# EasyEDA Pro project 中二手台.epro

# Schematic Schematic2
Create Date: 2024-07-02; Page Name: P1; Project Name: 若珺中二手台; Schematic Name: Schematic2; Update Date: 2024-07-21; Company: 嘉立创EDA; Page Size: A4; Version: V1.0
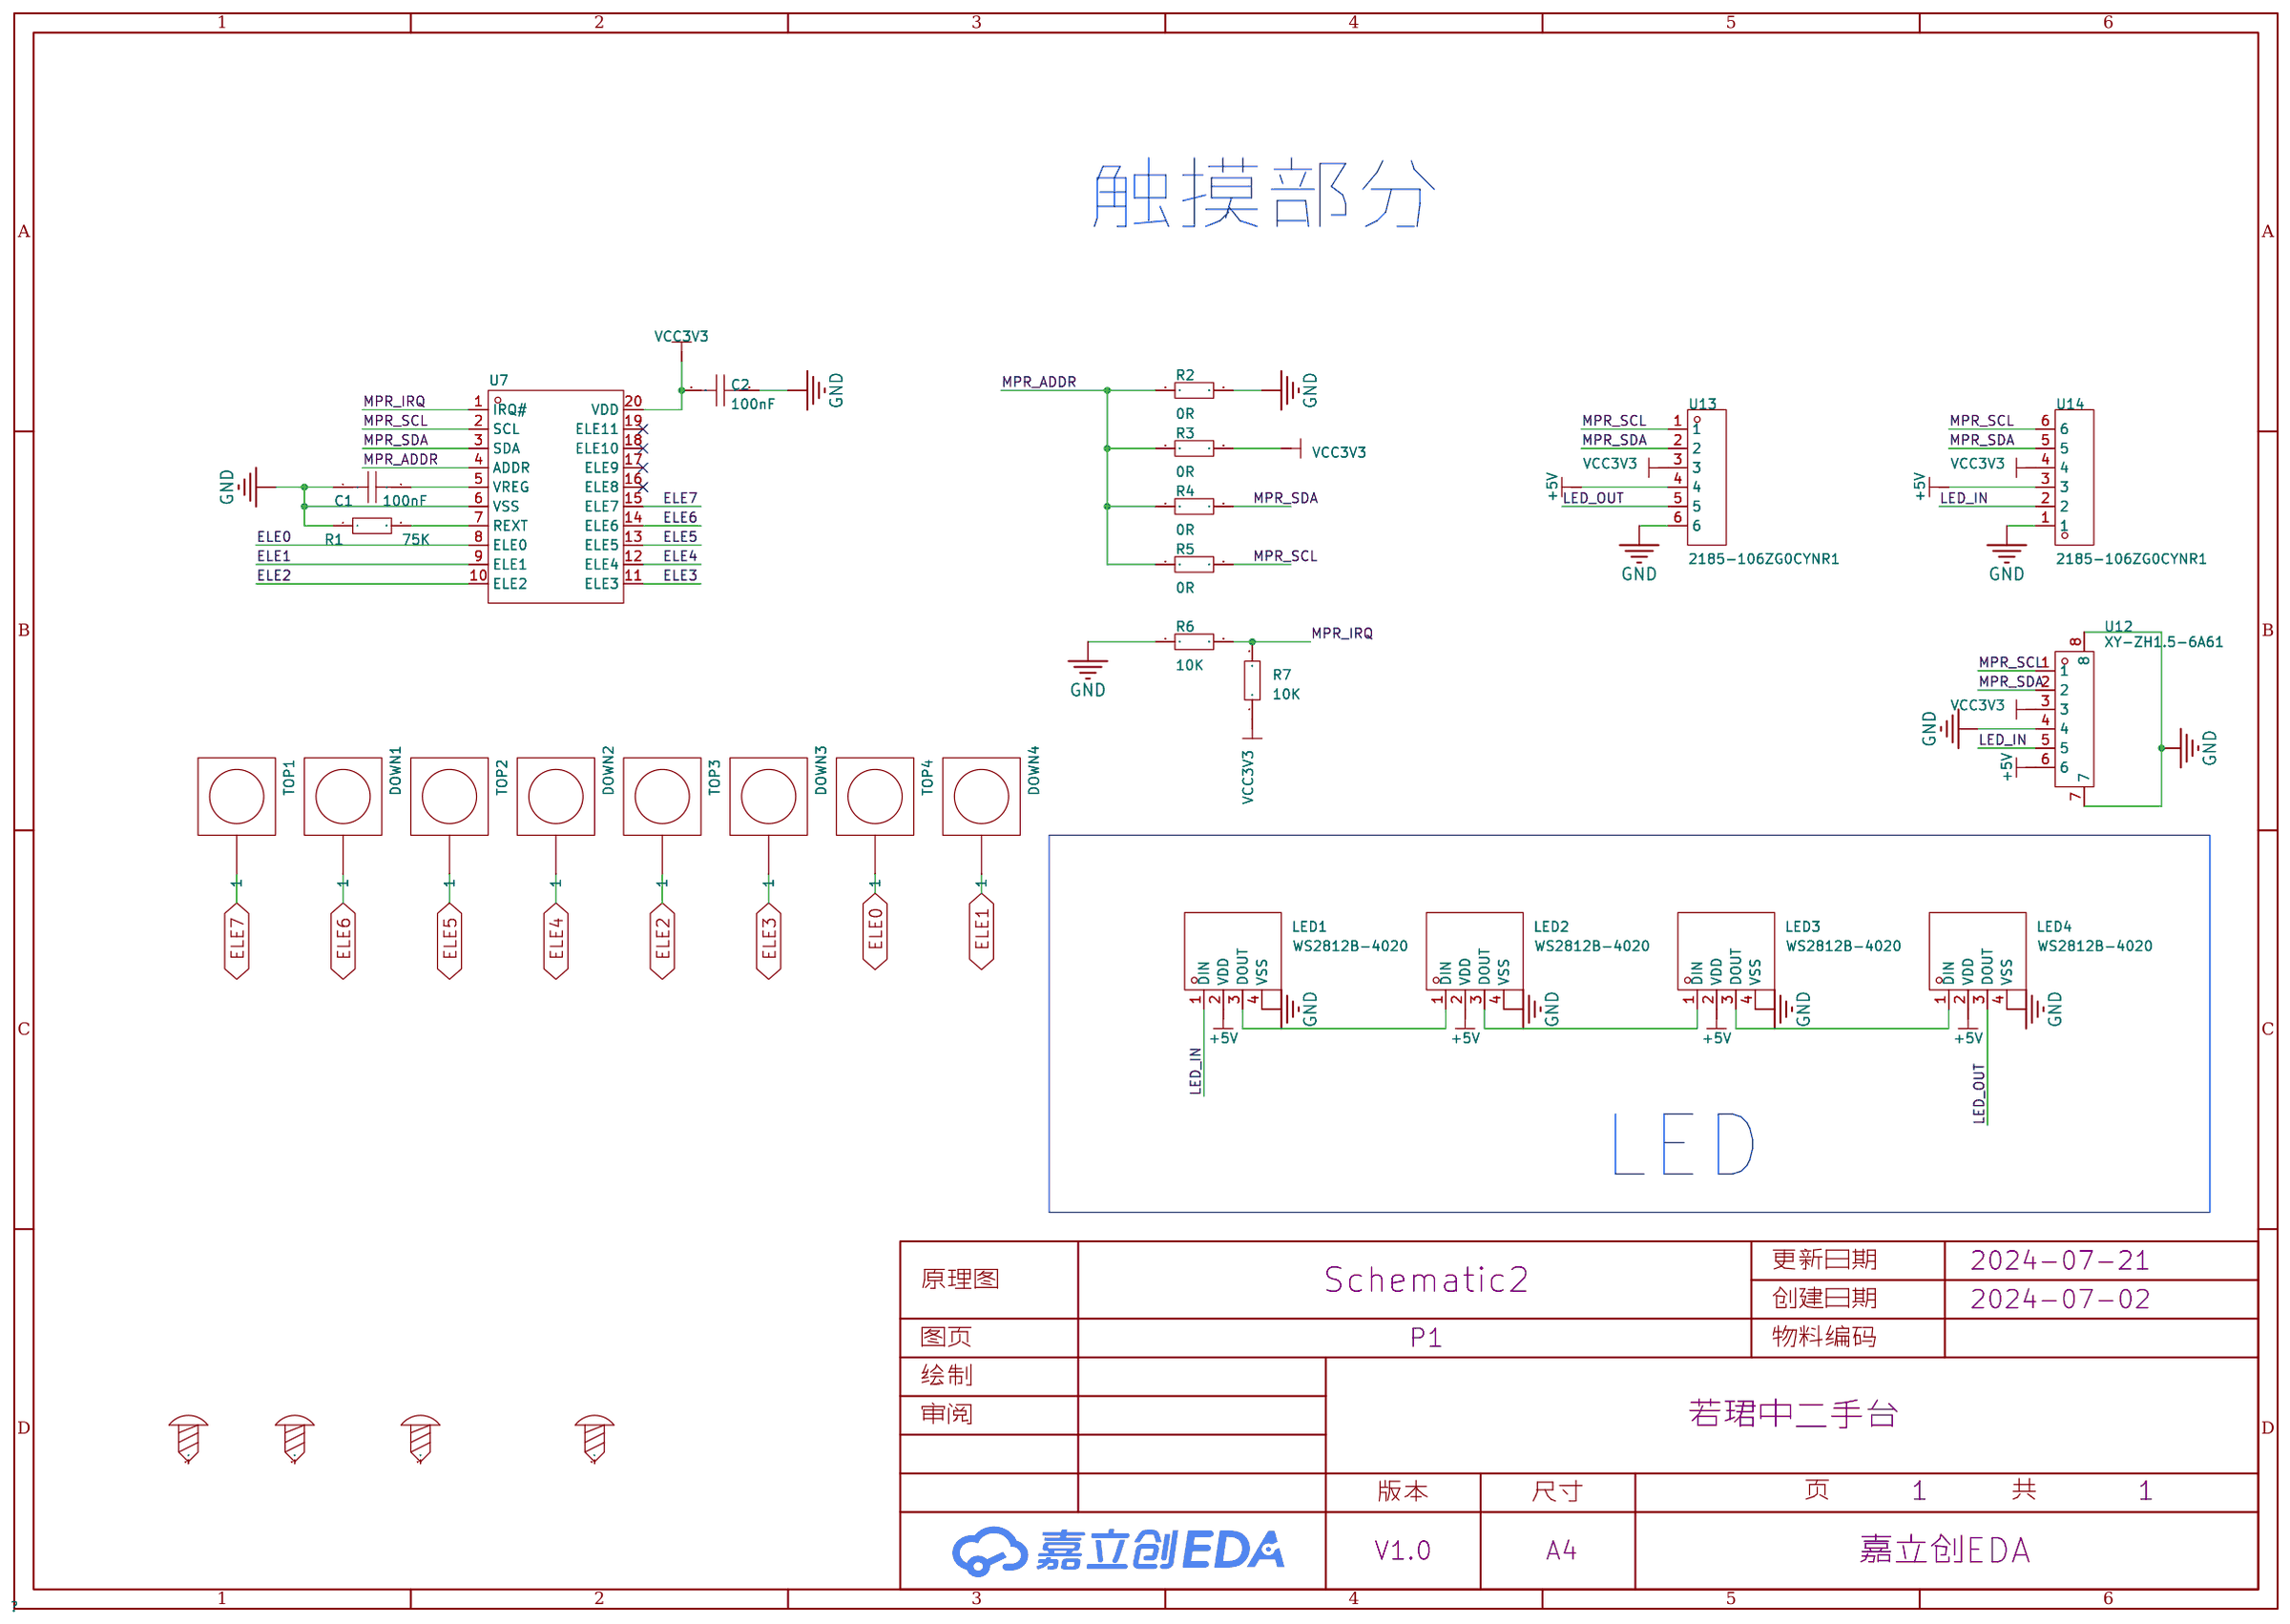
[diagram p0: schematic sheet]

## Parts
C1  100nF  [C0603]
C2  100nF  [C0603]
DOWN1  -  [触摸区域-焊盘]
DOWN2  -  [触摸区域-焊盘]
DOWN3  -  [触摸区域-焊盘]
DOWN4  -  [触摸区域-焊盘]
LED1  WS2812B-4020  [LED-SMD_WS2812B-4020]
LED2  WS2812B-4020  [LED-SMD_WS2812B-4020]
LED3  WS2812B-4020  [LED-SMD_WS2812B-4020]
LED4  WS2812B-4020  [LED-SMD_WS2812B-4020]
R1  75K  [R0603]
R2  0R  [R0603]
R3  0R  [R0603]
R4  0R  [R0603]
R5  0R  [R0603]
R6  10K  [R0603]
R7  10K  [R0603]
SCREW5  -  [M2螺丝]
SCREW6  -  [M2螺丝]
SCREW7  -  [M2螺丝]
SCREW8  -  [M2螺丝]
TOP1  -  [触摸区域-焊盘]
TOP2  -  [触摸区域-焊盘]
TOP3  -  [触摸区域-焊盘]
TOP4  -  [触摸区域-焊盘]
U7  -  [QFN-20_L3.0-W3.0-P0.40-BL]
U12  XY-ZH1.5-6A61  [CONN-SMD_6P-P1.50_XY-ZH1.5-6A61]
U13  2185-106ZG0CYNR1  [HDR-SMD_6P-P2.54-V-F_2185-106ZG0CYNR1]
U14  2185-106ZG0CYNR1  [HDR-SMD_6P-P2.54-V-F_2185-106ZG0CYNR1]

## Library data of the parts
C1 C2 = CAP_0603: Supplier Footprint: 0603
DOWN1-DOWN4 TOP1-TOP4 = 连接点（正方形，多层）
LED1-LED4 = WS2812B-4020: 发光颜色:RGB三色;二极管配置:-;透镜颜色:-;主波长:465nm~475nm；620nm~625nm；515nm~525nm;峰值波长:-;色温:-;测试电流:12mA;功率:-;发光角度:-;安装方式:-;工作温度:-;; LCSC Part Name: RGB三色 465nm~475nm 515nm~525nm 620nm~625nm （注意防潮，请查阅规格书中对应具体内容）; Supplier Part: C965557; Manufacturer: worldsemi; Supplier Footprint: SMD,2x4mm; JLCPCB Part Class: Extended Part; Datasheet: https://atta.szlcsc.com/upload/public/pdf/source/20201203/C965557_D4D919E14814D6BA44043987D39B5520.pdf; Supplier: LCSC; Emitted Color: RGB三色; Dominant Wavelength: 465nm~475nm；620nm~625nm；515nm~525nm; Forward Current: 12mA
R1-R7 = Res_0603: Supplier Footprint: 0603
SCREW5-SCREW8 = M2螺丝: Supplier Footprint: 插件
U7 = MPR121QR2: Supplier Part: C91322; Manufacturer: NXP(恩智浦); Supplier Footprint: QFN-20; JLCPCB Part Class: Extended Part; Datasheet: https://atta.szlcsc.com/upload/public/pdf/source/20180709/C91322_1B52007B7B61B701B66428E654A9AEF1.pdf; Supplier: LCSC
U12 = XY-ZH1.5-6A61: 插针结构:1x6P;间距:1.5mm;安装方式:卧贴;总PIN数:6P;排数:1;每排PIN数:6;行距:3.3mm;; LCSC Part Name: 间距:1.5mm 1x6P 卧贴; Supplier Part: C19272081; Manufacturer: XYECONN(辛译); Supplier Footprint: SMD,P=1.5mm,卧贴; Datasheet: https://atta.szlcsc.com/upload/public/pdf/source/20231128/469DECC5125F2C64AF36B40FBD9D9B8C.pdf; Supplier: LCSC; Pins Structure: 1x6P; Pitch: 1.5mm; Mounting Style: 卧贴; Number of Pins: 6P; Number of Rows: 1; Number of PINs Per Row: 6; Row Spacing: 3.3mm
U13 U14 = 2185-106ZG0CYNR1: Supplier Part: C9900021635; Supplier Footprint: HDR-SMD_6P-P2.54; JLCPCB Part Class: 扩展库; Supplier: LCSC

## Nets
+5V: LED1.2(VDD) LED2.2(VDD) LED3.2(VDD) LED4.2(VDD) U12.6 U13.4 U14.3
GND: C1.1 C2.2 LED1.4(VSS) LED2.4(VSS) LED3.4(VSS) LED4.4(VSS) R1.1 R2.2 R6.1 U7.6(VSS) U12.4 U12.7 U12.8 U13.6 U14.1
VCC3V3: C2.1 R3.2 R7.1 U7.20(VDD) U12.3 U13.3 U14.4
ELE0: TOP4.1 U7.8(ELE0)
ELE1: DOWN4.1 U7.9(ELE1)
ELE2: TOP3.1 U7.10(ELE2)
ELE3: DOWN3.1 U7.11(ELE3)
ELE4: DOWN2.1 U7.12(ELE4)
ELE5: TOP2.1 U7.13(ELE5)
ELE6: DOWN1.1 U7.14(ELE6)
ELE7: TOP1.1 U7.15(ELE7)
LED_IN: LED1.1(DIN) U12.5 U14.2
LED_OUT: LED4.3(DOUT) U13.5
MPR_ADDR: R2.1 R3.1 R4.1 R5.1 U7.4(ADDR)
MPR_IRQ: R6.2 R7.2 U7.1(IRQ#)
MPR_SCL: R5.2 U7.2(SCL) U12.1 U13.1 U14.6
MPR_SDA: R4.2 U7.3(SDA) U12.2 U13.2 U14.5
$1N5130: C1.2 U7.5(VREG)
$1N5218: R1.2 U7.7(REXT)
$1N6408: LED1.3(DOUT) LED2.1(DIN)
$1N6409: LED2.3(DOUT) LED3.1(DIN)
$1N6410: LED3.3(DOUT) LED4.1(DIN)

Not connected (* = marked no-connect by the designer): SCREW5 1; SCREW6 1; SCREW7 1; SCREW8 1; U7 16(ELE8)* 17(ELE9)* 18(ELE10)* 19(ELE11)*

## Notes on the sheet
- 触摸部分
- LED

# Schematic Schematic1
Create Date: 2024-06-29; Page Name: 主控天健; Project Name: 若珺中二手台; Schematic Name: Schematic1; Update Date: 2024-08-07; Company: 嘉立创EDA; Page Size: A4; Version: V1.0
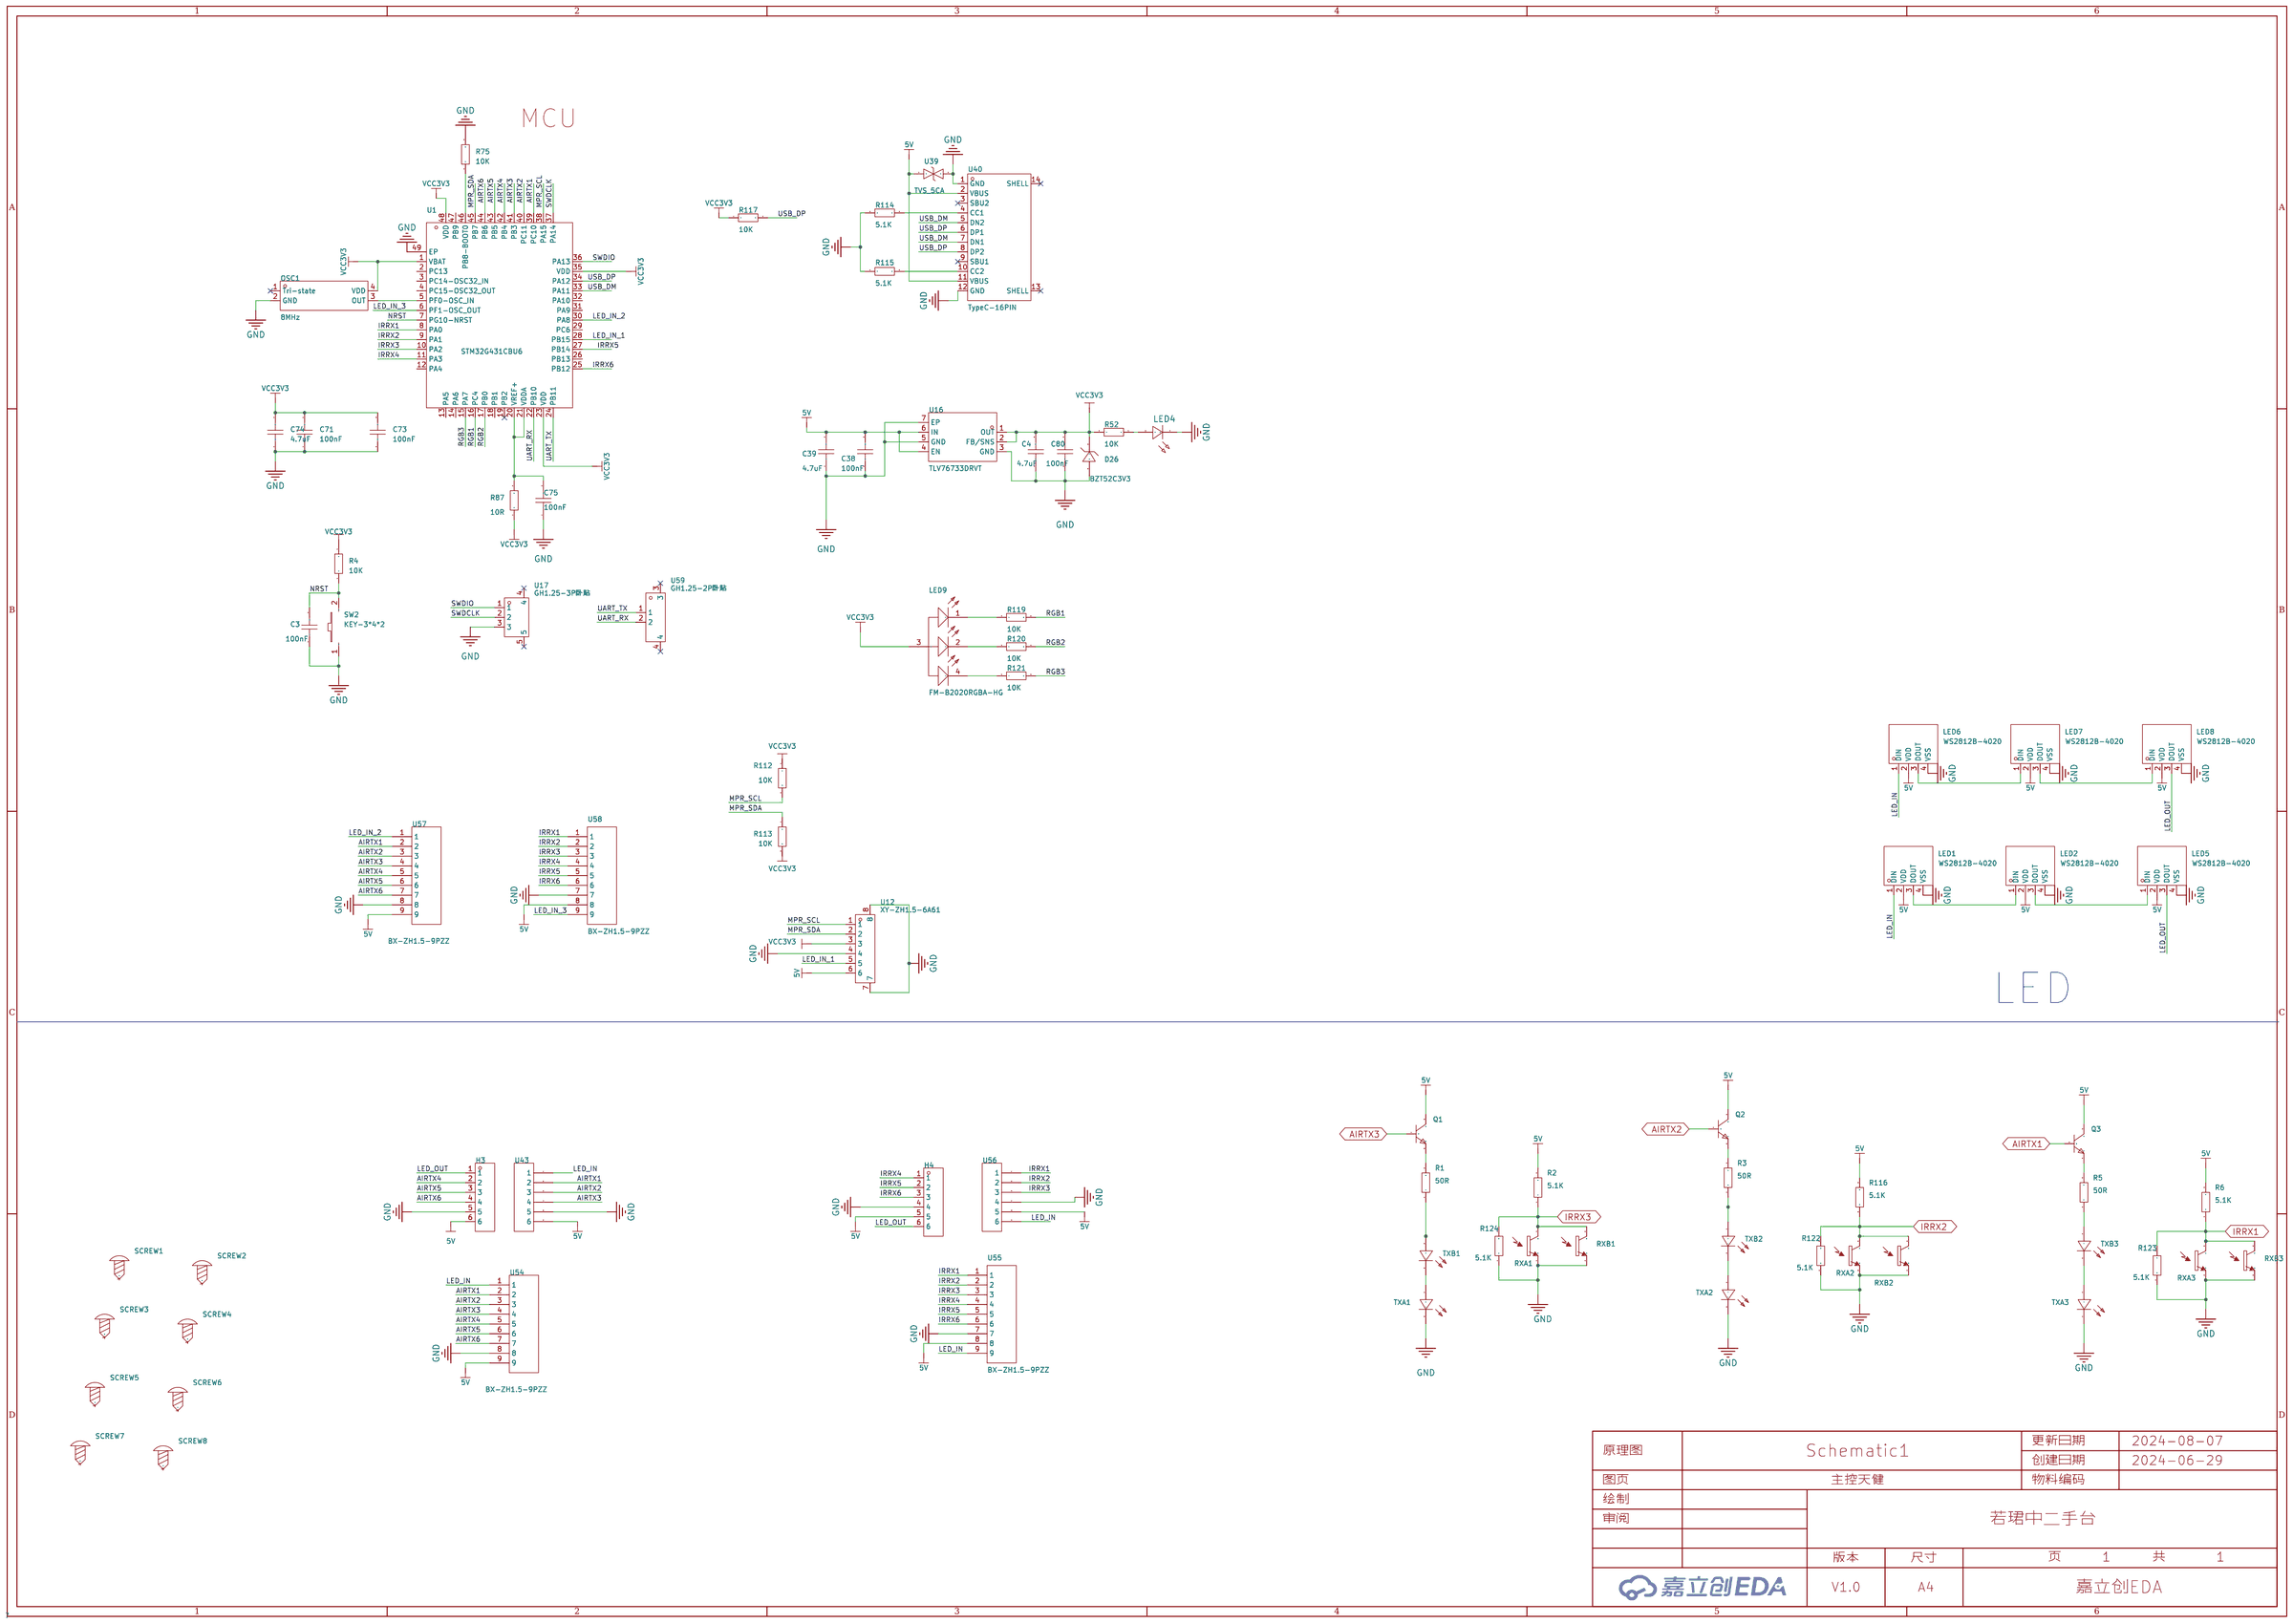
[diagram p1: schematic sheet]

## Parts
C3  100nF  [C0402]
C4  4.7uF  [c0402_new]
C38  100nF  [c0402_new]
C39  4.7uF  [c0402_new]
C71  100nF  [C0402]
C73  100nF  [C0402]
C74  4.7uF  [C0402]
C75  100nF  [C0402]
C80  100nF  [c0402_new]
D26  BZT52C3V3  [SOD-123_L2.7-W1.6-LS3.7-RD-1]
H3  -  [HDR-TH_6P-P2.54-V-F]
H4  -  [HDR-TH_6P-P2.54-V-F]
LED1  WS2812B-4020  [LED-SMD_WS2812B-4020]
LED2  WS2812B-4020  [LED-SMD_WS2812B-4020]
LED4  -  [LED_0402]
LED5  WS2812B-4020  [LED-SMD_WS2812B-4020]
LED6  WS2812B-4020  [LED-SMD_WS2812B-4020]
LED7  WS2812B-4020  [LED-SMD_WS2812B-4020]
LED8  WS2812B-4020  [LED-SMD_WS2812B-4020]
LED9  FM-B2020RGBA-HG  [LED-SMD_FM-B2020RGBA-HG]
OSC1  8MHz  [OSC-SMD_4P-L3.2-W2.5-BL-1]
Q1  -  [SOT-23-3_L2.9-W1.3-P1.90-LS2.4-BR]
Q2  -  [SOT-23-3_L2.9-W1.3-P1.90-LS2.4-BR]
Q3  -  [SOT-23-3_L2.9-W1.3-P1.90-LS2.4-BR]
R1  50R  [R0603]
R2  5.1K  [R0603]
R3  50R  [R0603]
R4  10K  [R0402]
R5  50R  [R0603]
R6  5.1K  [R0603]
R52  10K  [R0402]
R75  10K  [R0603]
R87  10R  [R0402]
R112  10K  [R0402]
R113  10K  [R0402]
R114  5.1K  [R0603]
R115  5.1K  [R0603]
R116  5.1K  [R0603]
R117  10K  [R0603]
R119  10K  [R0402]
R120  10K  [R0402]
R121  10K  [R0402]
R122  5.1K  [R0603]
R123  5.1K  [R0603]
R124  5.1K  [R0603]
RXA1  -  [LED-TH_BD5.0-P2.54-RD]
RXA2  -  [LED-TH_BD5.0-P2.54-RD]
RXA3  -  [LED-TH_BD5.0-P2.54-RD]
RXB1  -  [LED-TH_BD5.0-P2.54-RD]
RXB2  -  [LED-TH_BD5.0-P2.54-RD]
RXB3  -  [LED-TH_BD5.0-P2.54-RD]
SCREW1  -  [M2螺丝]
SCREW2  -  [M2螺丝]
SCREW3  -  [M2螺丝]
SCREW4  -  [M2螺丝]
SCREW5  -  [M2螺丝]
SCREW6  -  [M2螺丝]
SCREW7  -  [M2螺丝]
SCREW8  -  [M2螺丝]
SW2  KEY-3*4*2  [SW-SMD_L4.0-W2.9-LS5.0]
TXA1  -  [LED-TH_BD5.0-P2.54-FD]
TXA2  -  [LED-TH_BD5.0-P2.54-FD]
TXA3  -  [LED-TH_BD5.0-P2.54-FD]
TXB1  -  [LED-TH_BD5.0-P2.54-FD]
TXB2  -  [LED-TH_BD5.0-P2.54-FD]
TXB3  -  [LED-TH_BD5.0-P2.54-FD]
U1  STM32G431CBU6  [UFQFPN-48_L7.0-W7.0-P0.50-BL-EP]
U12  XY-ZH1.5-6A61  [CONN-SMD_6P-P1.50_XY-ZH1.5-6A61]
U16  TLV76733DRVT  [WSON-6_L2.0-W2.0-P0.65-TL-EP]
U17  GH1.25-3P卧贴  [CONN-SMD_GH1.25-3P]
U39  TVS_5CA  [SMA_L4.3-W2.7-LS5.0-BI]
U40  TypeC-16PIN  [USB-C-SMD_TYPE-C-6PIN-2MD-073]
U43  -  [5P_pcb接口-2.54mm]
U54  BX-ZH1.5-9PZZ  [CONN-TH_9P-P1.50_ZH-1.5]
U55  BX-ZH1.5-9PZZ  [CONN-TH_9P-P1.50_ZH-1.5]
U56  -  [5P_pcb接口-2.54mm]
U57  BX-ZH1.5-9PZZ  [CONN-TH_9P-P1.50_ZH-1.5]
U58  BX-ZH1.5-9PZZ  [CONN-TH_9P-P1.50_ZH-1.5]
U59  GH1.25-2P卧贴  [CONN-SMD_2P-P1.25_GH1.25-2P]

## Library data of the parts
C3 C71 C73-C75 = CAP_0402: Supplier Footprint: 0402
C4 C38 C39 C80 = CAP_0603: Supplier Footprint: 0603
D26 = BZT52C3V3: 二极管配置:-;稳压值(标称值):3.3V;稳压值(范围):3.3V~3.5V;功率:500mW;; Supplier Part: C2891770; Manufacturer: YONGYUTAI(永裕泰); Supplier Footprint: SOD-123; JLCPCB Part Class: 扩展库; Datasheet: https://atta.szlcsc.com/upload/public/pdf/source/20210901/8FC2376A01E96D0346FF8B134DC7A446.pdf; Supplier: LCSC; Zener Voltage (Nom): 3.3V; Reverse Leakage Current (Ir): 5uA@1V; Zener Voltage (Range): 3.3V~3.5V; Power Dissipation: 500mW; Zener Impedance (Zzt): 95Ω
H3 H4 = HDR-F_2.54_1x6P: Supplier Part: C40877; Supplier Footprint: 插件
LED1 LED2 LED5-LED8 = WS2812B-4020: 发光颜色:RGB三色;二极管配置:-;透镜颜色:-;主波长:465nm~475nm；620nm~625nm；515nm~525nm;峰值波长:-;色温:-;测试电流:12mA;功率:-;发光角度:-;安装方式:-;工作温度:-;; LCSC Part Name: RGB三色 465nm~475nm 515nm~525nm 620nm~625nm （注意防潮，请查阅规格书中对应具体内容）; Supplier Part: C965557; Manufacturer: worldsemi; Supplier Footprint: SMD,2x4mm; JLCPCB Part Class: Extended Part; Datasheet: https://atta.szlcsc.com/upload/public/pdf/source/20201203/C965557_D4D919E14814D6BA44043987D39B5520.pdf; Supplier: LCSC; Emitted Color: RGB三色; Dominant Wavelength: 465nm~475nm；620nm~625nm；515nm~525nm; Forward Current: 12mA
LED4 = LED_0402-R: Supplier Footprint: 0402
LED9 = FM-B2020RGBA-HG: 金线; Supplier Part: C108793; Manufacturer: 国星光电; Supplier Footprint: SMD,2.1x2.1mm; Datasheet: https://atta.szlcsc.com/upload/public/pdf/source/20180518/C108793_2518890ED811E900864AC79152D9E220.pdf; Supplier: LCSC
OSC1 = OT2EL4C4JI-111OLP-8M: 频率:8MHz;常温频差:±10ppm;输出模式:CMOS;工作电压:1.8V~3.3V;; LCSC Part Name: 8MHZ?1.8V-3.3V?±10PPM YSO110TR; Supplier Part: C5189450; Manufacturer: YXC(扬兴晶振); Supplier Footprint: SMD3225-4P; Datasheet: https://atta.szlcsc.com/upload/public/pdf/source/20221009/1148DEA51132416CC556CBB25766F9C8.pdf; Supplier: LCSC; Normal temperature Frequency Tolerance: ±10ppm; Output Type: CMOS; Supply Voltage: 1.8V~3.3V; Operating Temperature: -40℃~+85℃
Q1-Q3 = SS8050: 晶体管类型:NPN;集射极击穿电压(Vceo):25V;集电极电流(Ic):1.5A;功率(Pd):-;集电极-发射极饱和电压(VCE(sat)@Ic,Ib):500mV@800mA,80mA;直流电流增益(hFE@Ic,Vce):-;特征频率(fT):100MHz;工作温度:+150@(Tj);; LCSC Part Name: NPN 25V 1.5A; Supplier Part: C2840974; Manufacturer: PSI(宝力芯); Supplier Footprint: SOT-23; JLCPCB Part Class: Extended Part; Datasheet: https://atta.szlcsc.com/upload/public/pdf/source/20210621/C2840974_4462265728B1960D50E1D396ECABF315.pdf; Supplier: LCSC; Transistor Type: NPN; Collector-Emitter Breakdown Voltage (Vceo): 25V; Collector Current (Ic): 1.5A; Collector-Emitter Saturation Voltage (VCE(sat)@Ic,Ib): 500mV@800mA,80mA; Transition Frequency (fT): 100MHz; Operating Temperature: +150@(Tj)
R1-R3 R5 R6 R75 R114-R117 R122-R124 = Res_0603: Supplier Footprint: 0603
R4 R52 R87 R112 R113 R119-R121 = Res_0402: Supplier Footprint: 0402
RXA1-RXA3 RXB1-RXB3 = PT334-6C: Supplier Part: C264296; Manufacturer: EVERLIGHT(台湾亿光); Supplier Footprint: Through Hole; JLCPCB Part Class: Extended Part; Datasheet: https://atta.szlcsc.com/upload/public/pdf/source/20180817/C264296_4CDBAB9CD3E8C19735C029B1D16915BE.pdf; Supplier: LCSC
SCREW1-SCREW8 = M2螺丝: Supplier Footprint: 插件
SW2 = KEY-3*4*2: Supplier Part: C9900015662; Supplier Footprint: KEY; JLCPCB Part Class: 扩展库; Datasheet: https://atta.szlcsc.comnull; Supplier: LCSC
TXA1-TXA3 TXB1-TXB3 = IR333C-A R档: 波长:940nm;正向电流-DC (If):1A;正向电压（Vf）:1.2V;辐射强度:20mW/sr @ 20mA;; Supplier Part: C139041; Manufacturer: EVERLIGHT(台湾亿光); Supplier Footprint: Through Hole; JLCPCB Part Class: Extended Part; Datasheet: https://atta.szlcsc.com/upload/public/pdf/source/20200901/C139041_BA2A61038D5D2ACE305D10F8330117FC.pdf; Supplier: LCSC; Wavelength: 940nm; Current - DC Forward (If) (Max): 1A; Vf - Forward Voltage: 1.2V; Radiant Intensity: 20mW/sr @ 20mA; Operating Temperature: -25~85
U1 = STM32G431CBU6: CPU内核:ARM-M系列;程序存储容量:128KB;RAM总容量:32KB;GPIO端口数量:42;工作电压范围:1.71V~3.6V;CPU最大主频:170MHz;程序存储器类型:FLASH;; Supplier Part: C529356; Manufacturer: ST(意法半导体); Supplier Footprint: UFQFPN-48(7x7); JLCPCB Part Class: 扩展库; Datasheet: https://atta.szlcsc.com/upload/public/pdf/source/20200511/C529354_7C66CF00837B904D0C15DCE45B69418C.pdf; Supplier: LCSC; CPU Core: ARM-M系列; Program Storage Size: 128KB; RAM Size: 32KB; GPIO Ports Number: 42; Operating Voltage Range: 1.71V~3.6V; CPU Maximum Speed: 170MHz; Program Memory Type: FLASH; Operating Temperature Range: -40℃~+85℃; ADC (Bit): 12bit; DAC (Bit): 12bit; Peripheral/Function: DMA；PWM; Watchdog: 有; Infrared Data Association: 有; Low-Voltage Detect: 有; Direct Memory Access: 有; Internal Oscillator: 有
U12 = XY-ZH1.5-6A61: 插针结构:1x6P;间距:1.5mm;安装方式:卧贴;总PIN数:6P;排数:1;每排PIN数:6;行距:3.3mm;; LCSC Part Name: 间距:1.5mm 1x6P 卧贴; Supplier Part: C19272081; Manufacturer: XYECONN(辛译); Supplier Footprint: SMD,P=1.5mm,卧贴; Datasheet: https://atta.szlcsc.com/upload/public/pdf/source/20231128/469DECC5125F2C64AF36B40FBD9D9B8C.pdf; Supplier: LCSC; Pins Structure: 1x6P; Pitch: 1.5mm; Mounting Style: 卧贴; Number of Pins: 6P; Number of Rows: 1; Number of PINs Per Row: 6; Row Spacing: 3.3mm
U16 = TLV76733DRVT: 输出类型:固定;最大输入电压:16V;输出电压:3.3V;最大输出电流:1A;电源纹波抑制比(PSRR):70dB@(120Hz);输出极性:正极;; Supplier Part: C2867572; Manufacturer: TI(德州仪器); Supplier Footprint: WSON-6-EP(2x2); JLCPCB Part Class: 扩展库; Datasheet: https://www.ti.com/cn/lit/gpn/tlv767; Supplier: LCSC; Output Type: 固定; Maximum Input Voltage: 16V; Output Voltage: 3.3V; MAX Output Current: 1A; Power Supply Rejection Ratio (PSRR): 70dB@(120Hz); Dropout Voltage: 900mV@(1A); standby current: 80uA; Operating Temperature: -40℃~+125℃@(Tj); Output Polarity: 正极; Number of Outputs: 1
U17 = GH1.25-3P卧贴: Supplier Part: C9900014671; JLCPCB Part Class: 扩展库; Supplier: LCSC
U39 = 贴片双向TVS瞬态二极管SMAJ5.0CA,DO-214AA封装: Supplier Part: C9900010931; JLCPCB Part Class: 扩展库; Supplier: LCSC
U40 = TypeC-16PIN: Supplier Part: C9900016187; JLCPCB Part Class: 扩展库; Datasheet: 2022-04-26/182445A/86ade1b3bc5841688e69f2c7e7e4613d/TYPEC母座.pdf; Supplier: LCSC
U43 U56 = 5P_PCB连接口
U54 U55 U57 U58 = BX-ZH1.5-9PZZ: 插针结构:1x9P;间距:1.5mm;安装方式:直插;参考系列:ZH;总PIN数:9P;排数:1;每排PIN数:9;行距:-;额定电流:3A;触头材质:黄铜;触头镀层:锡;工作温度范围:-25℃~+85℃;; Supplier Part: C18077734; Manufacturer: Bossie(博锡); Supplier Footprint: 插件,P=1.5mm; Datasheet: https://atta.szlcsc.com/upload/public/pdf/source/20231017/91780A8134BAEFDB2D421F2985A9F6A4.pdf; Supplier: LCSC; Pins Structure: 1x9P; Pitch: 1.5mm; Mounting Style: 直插; Reference Series: ZH; Number of Pins: 9P; Number of Rows: 1; Number of PINs Per Row: 9; Current Rating (Max): 3A; Contact Material: 黄铜; Contact Plating: 锡; Operating Temperature Range: -25℃~+85℃
U59 = GH1.25-2P卧贴: Supplier Part: C9900014668; JLCPCB Part Class: 扩展库; Supplier: LCSC

## Nets
5V: C38.2 C39.2 H3.6 H4.5 LED1.2(VDD) LED2.2(VDD) LED5.2(VDD) LED6.2(VDD) LED7.2(VDD) LED8.2(VDD) Q1.3(C) Q2.3(C) Q3.3(C) R2.2 R6.2 R116.2 U12.6 U16.4(EN) U16.6(IN) U39.1 U40.2(VBUS) U40.11(VBUS) U43.6 U54.9 U55.8 U56.5 U57.9 U58.8
GND: C3.1 C4.1 C38.1 C39.1 C71.1 C73.1 C74.1 C75.1 C80.1 D26.2 H3.5 H4.4 LED1.4(VSS) LED2.4(VSS) LED4.1(C) LED5.4(VSS) LED6.4(VSS) LED7.4(VSS) LED8.4(VSS) OSC1.2(GND) R75.2 R114.2 R115.1 R122.1 R123.1 R124.1 RXA1.1(E1) RXA2.1(E1) RXA3.1(E1) RXB1.1(E1) RXB2.1(E1) RXB3.1(E1) SW2.1 TXA1.2(-) TXA2.2(-) TXA3.2(-) U1.49(EP) U12.4 U12.7 U12.8 U16.3(GND) U16.5(GND) U16.7(EP) U17.3 U39.2 U40.1(GND) U40.12(GND) U43.5 U54.8 U55.7 U56.4 U57.8 U58.7
VCC3V3: C4.2 C71.2 C73.2 C74.2 C80.2 D26.1 LED9.3(A) OSC1.4(VDD) R4.2 R52.2 R87.1 R112.1 R113.2 R117.1 U1.1(VBAT) U1.23(VDD) U1.35(VDD) U1.48(VDD) U12.3 U16.1(OUT) U16.2(FB/SNS)
AIRTX1: Q3.1(B) U1.39(PC10) U43.2 U54.2 U57.2
AIRTX2: Q2.1(B) U1.40(PC11) U43.3 U54.3 U57.3
AIRTX3: Q1.1(B) U1.41(PB3) U43.4 U54.4 U57.4
AIRTX4: H3.2 U1.42(PB4) U54.5 U57.5
AIRTX5: H3.3 U1.43(PB5) U54.6 U57.6
AIRTX6: H3.4 U1.44(PB6) U54.7 U57.7
IRRX1: R6.1 R123.2 RXA3.2(C1) RXB3.2(C1) U1.8(PA0) U55.1 U56.1 U58.1
IRRX2: R116.1 R122.2 RXA2.2(C1) RXB2.2(C1) U1.9(PA1) U55.2 U56.2 U58.2
IRRX3: R2.1 R124.2 RXA1.2(C1) RXB1.2(C1) U1.10(PA2) U55.3 U56.3 U58.3
IRRX4: H4.1 U1.11(PA3) U55.4 U58.4
IRRX5: H4.2 U1.27(PB14) U55.5 U58.5
IRRX6: H4.3 U1.25(PB12) U55.6 U58.6
LED_IN: LED1.1(DIN) LED6.1(DIN) U43.1 U54.1 U55.9 U56.6
LED_IN_1: U1.28(PB15) U12.5
LED_IN_2: U1.30(PA8) U57.1
LED_IN_3: U1.6(PF1-OSC_OUT) U58.9
LED_OUT: H3.1 H4.6 LED5.3(DOUT) LED8.3(DOUT)
MPR_SCL: R112.2 U1.38(PA15) U12.1
MPR_SDA: R113.1 U1.45(PB7) U12.2
NRST: C3.2 R4.1 SW2.2 U1.7(PG10-NRST)
RGB1: R119.2 U1.16(PC4)
RGB2: R120.2 U1.17(PB0)
RGB3: R121.2 U1.15(PA7)
SWDCLK: U1.37(PA14) U17.2
SWDIO: U1.36(PA13) U17.1
UART_RX: U1.22(PB10) U59.2
UART_TX: U1.24(PB11) U59.1
USB_DM: U1.33(PA11) U40.5(DN2) U40.7(DN1)
USB_DP: R117.2 U1.34(PA12) U40.6(DP1) U40.8(DP2)
$1N922: OSC1.3(OUT) U1.5(PF0-OSC_IN)
$1N942: R75.1 U1.46(PB8-BOOT0)
$1N1007: C75.2 R87.2 U1.20(VREF+) U1.21(VDDA)
$1N2453: LED4.2(A) R52.1
$1N3583: R114.1 U40.4(CC1)
$1N3584: R115.2 U40.10(CC2)
$1N5577: Q1.2(E) R1.2
$1N5585: Q2.2(E) R3.2
$1N5593: Q3.2(E) R5.2
$1N7163: LED1.3(DOUT) LED2.1(DIN)
$1N7164: LED2.3(DOUT) LED5.1(DIN)
$1N7689: LED6.3(DOUT) LED7.1(DIN)
$1N7690: LED7.3(DOUT) LED8.1(DIN)
$1N11987: R1.1 TXB1.1(+)
$1N12080: R3.1 TXB2.1(+)
$1N12243: R5.1 TXB3.1(+)
$1N23023: LED9.1(K) R119.1
$1N23025: LED9.2(K) R120.1
$1N23027: LED9.4(K) R121.1
$1N32572: TXA2.1(+) TXB2.2(-)
$1N32588: TXA1.1(+) TXB1.2(-)
$1N32593: TXA3.1(+) TXB3.2(-)

Not connected (* = marked no-connect by the designer): OSC1 1(Tri-state)*; SCREW1 1; SCREW2 1; SCREW3 1; SCREW4 1; SCREW5 1; SCREW6 1; SCREW7 1; SCREW8 1; U1 2(PC13) 3(PC14-OSC32_IN) 4(PC15-OSC32_OUT) 12(PA4) 13(PA5) 14(PA6) 18(PB1) 19(PB2)* 26(PB13) 29(PC6) 31(PA9) 32(PA10) 47(PB9); U17 4* 5*; U40 3(SBU2)* 9(SBU1)* 13(SHELL)* 14(SHELL)*; U59 3* 4*

## Notes on the sheet
- MCU
- LED

# Board PCB3
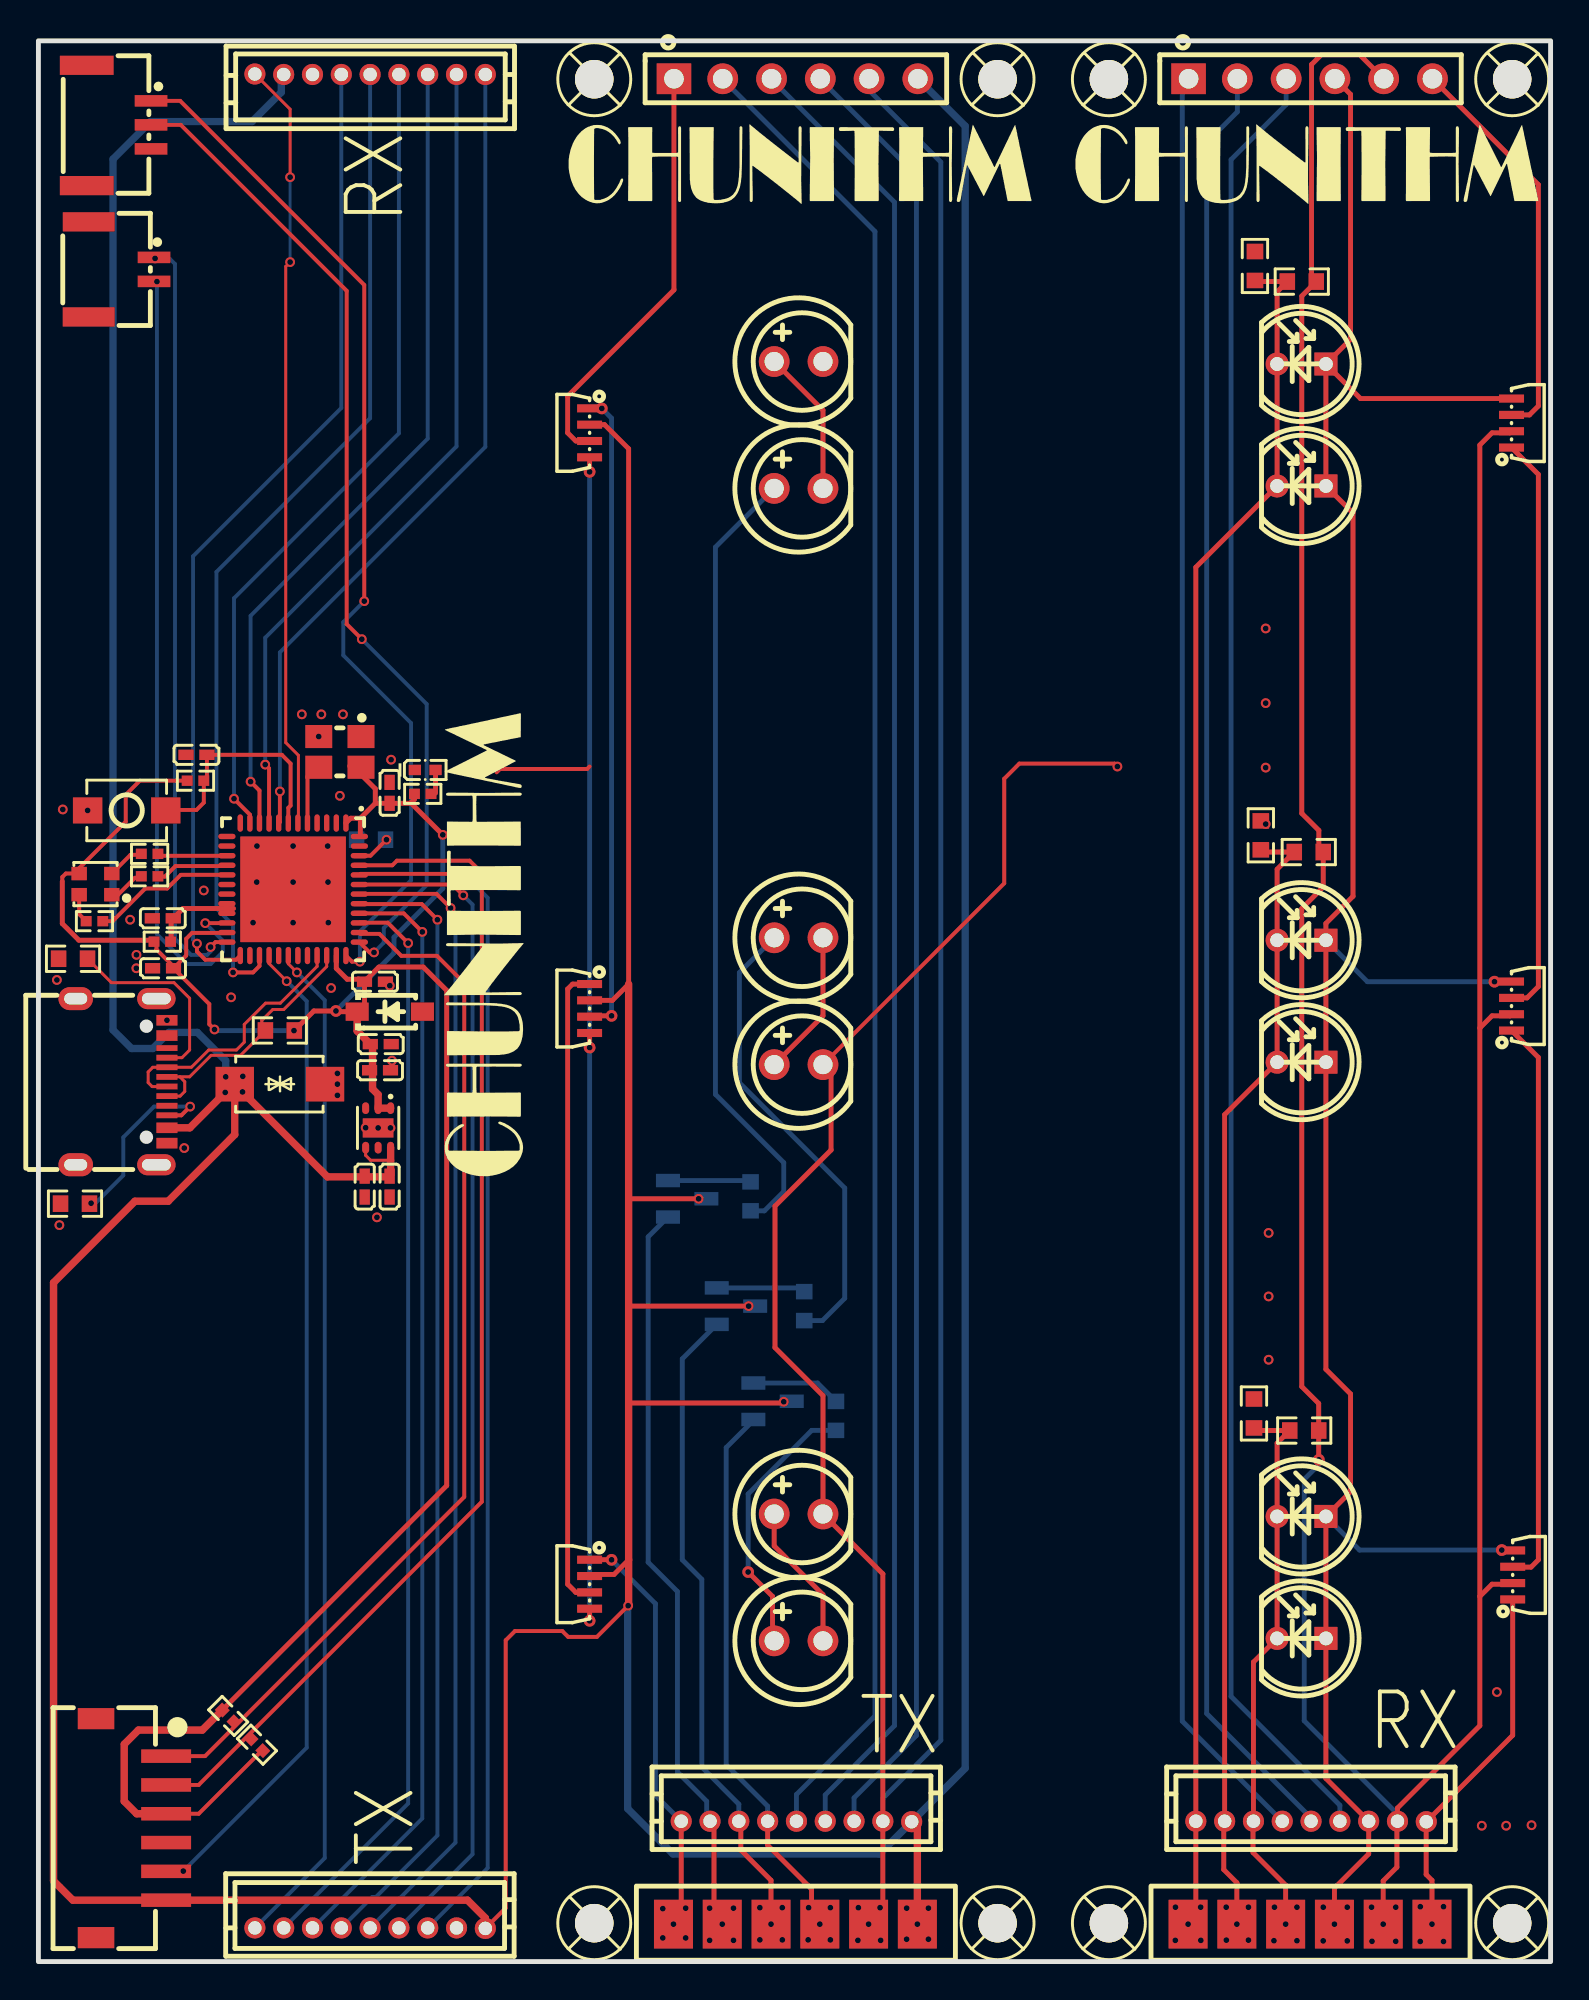
[diagram p2: board, top side]
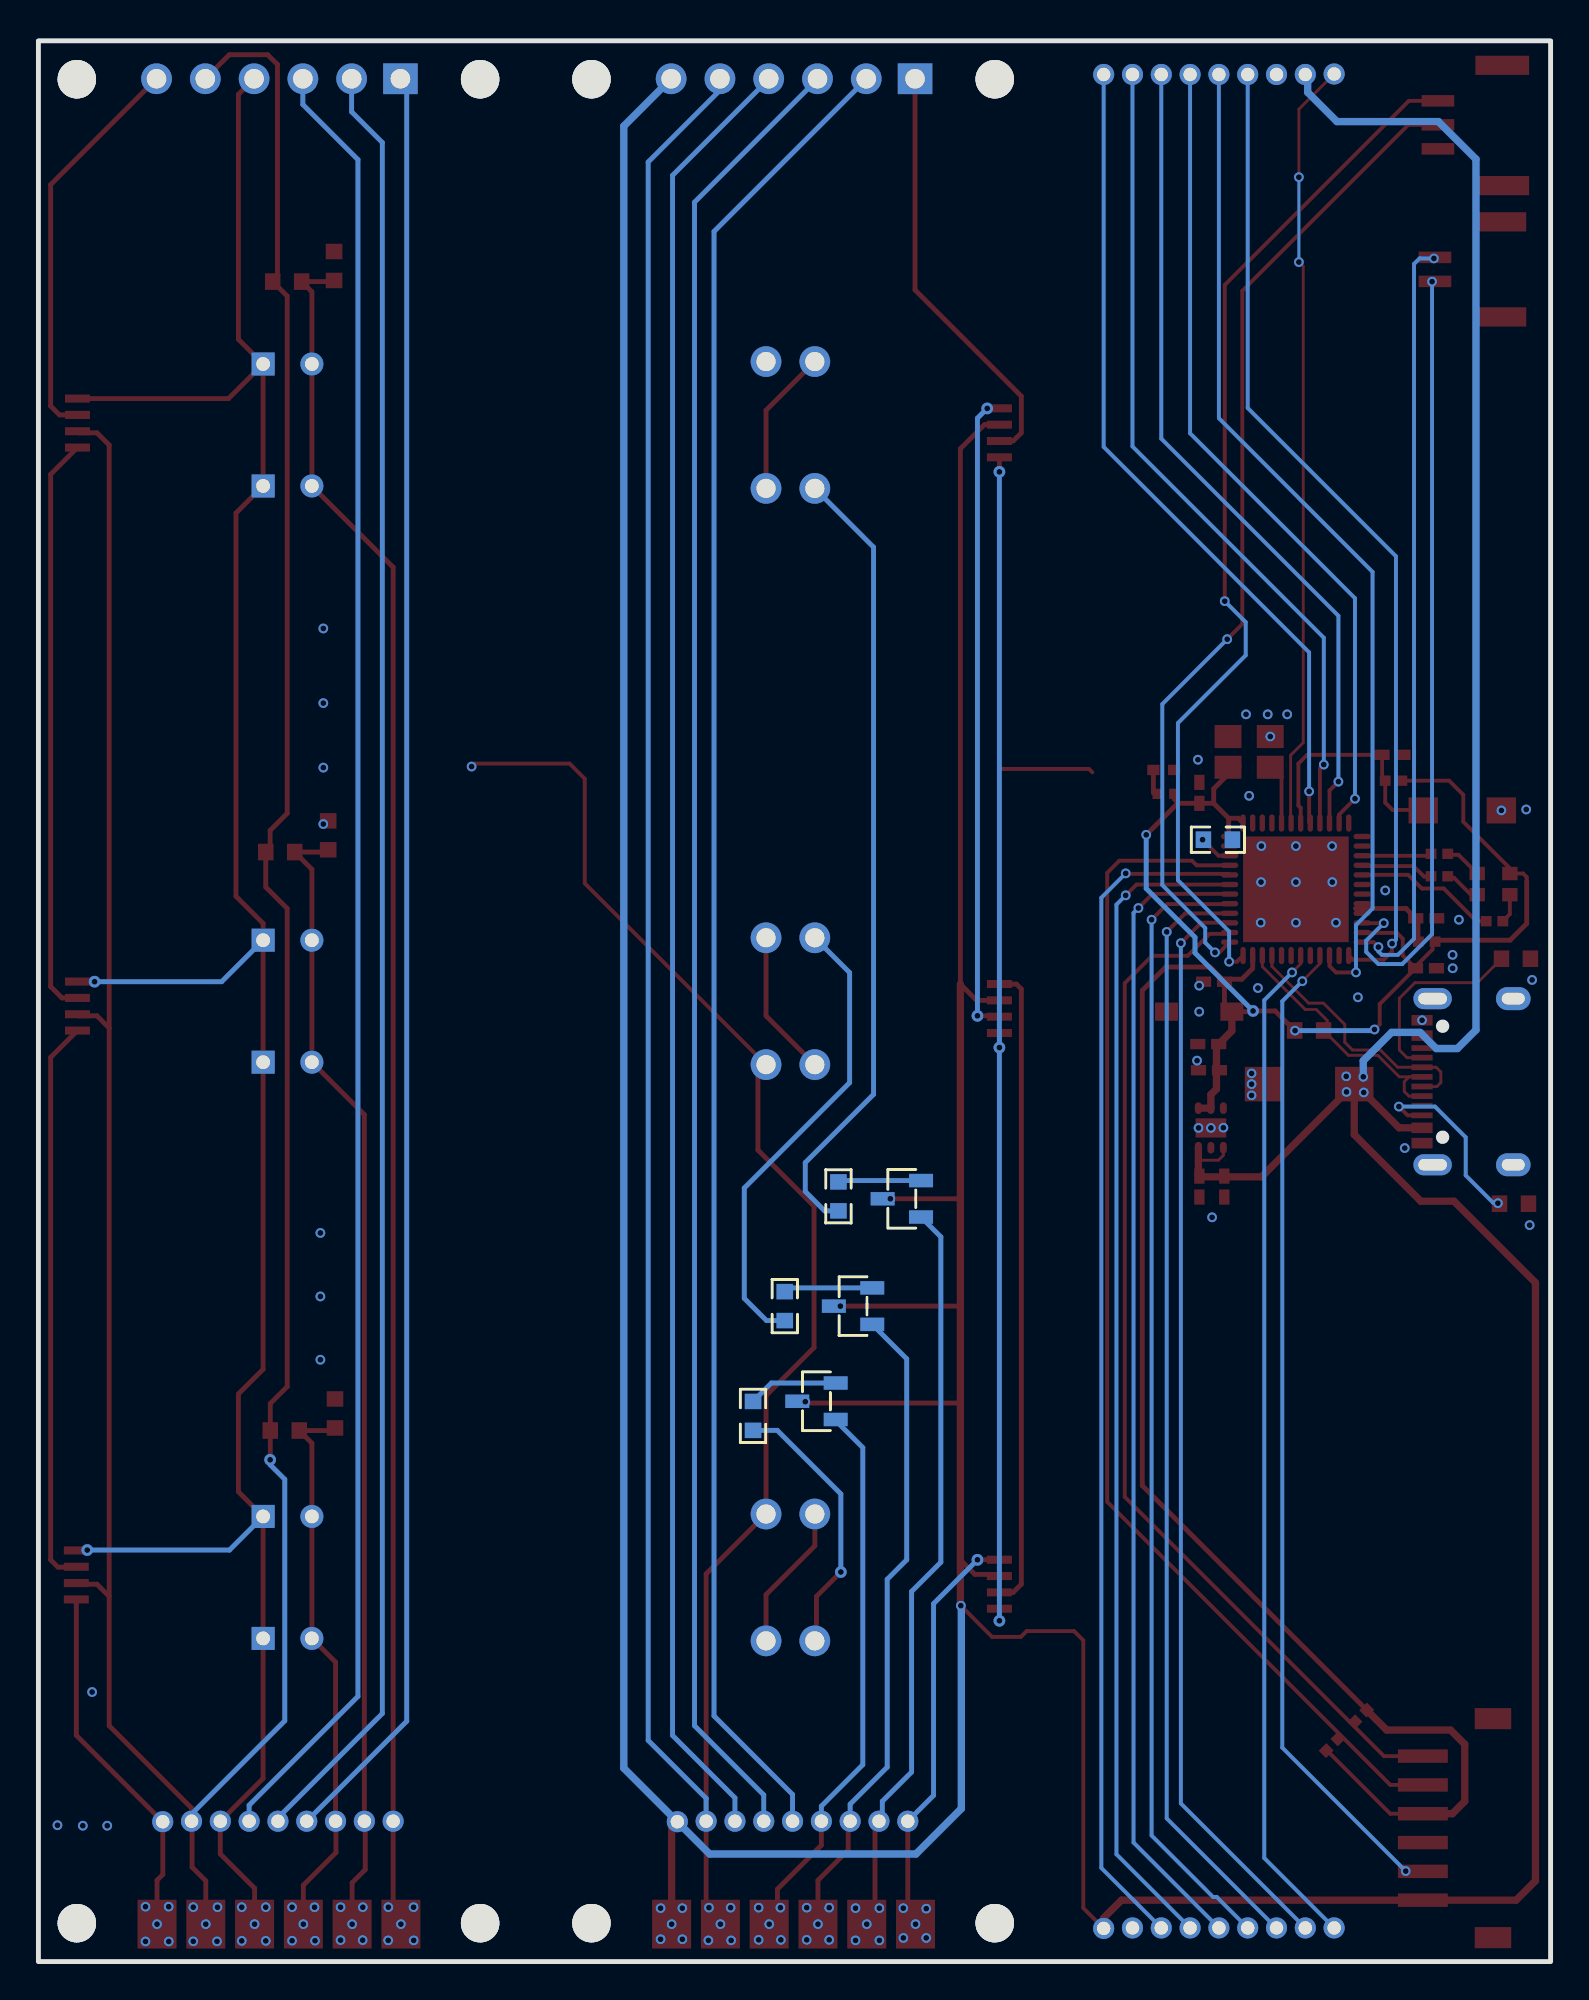
[diagram p3: board, bottom side, seen from below]

Outline 78.74 x 100 mm; copper layers: Top Layer, Bottom Layer. Coordinates in mm from the lower left corner of the outline.
Outline path: rectangle 0,100 78.74,0
Stack: Top Layer 0.035mm / Dielectric1 1.51mm FR4 er 4.5 / Bottom Layer 0.035mm

## Design rules (mm)
template: 自定义配置
spacing copperThickness1oz (default): track to track 0.102, other pairs 0.152 to 0.3
spacing copperThickness2oz: track to track 0.203, other pairs 0.152 to 0.3
track width copperThickness1oz (default): min 0.127, default 0.254, max 2.54
track width copperThickness2oz: min 0.203, default 0.254, max 2.54
differential pair differentialPair (default): width min 0.127, default 0.254, max 2.54; gap min 0.152, default 0.152
via viaSize (default): diameter min 0.5, default 0.61, max 10; hole min 0.3, default 0.305, max 6.3
pour e3218 uses copperRegion

## Placement (name value [footprint] x y rotation side)
C3  100nF  [C0402]  8.23 62.83 0 top
C4  4.7uF  [c0402_new]  17.79 46.41 180 top
C38  100nF  [c0402_new]  16.99 40.35 90 top
C39  4.7uF  [c0402_new]  18.29 40.35 90 top
C71  100nF  [C0402]  6.49 51.72 0 top
C73  100nF  [C0402]  18.29 60.85 270 top
C74  4.7uF  [C0402]  17.53 51.02 180 top
C75  100nF  [C0402]  6.48 54.32 0 top
C80  100nF  [c0402_new]  17.83 47.77 180 top
D26  BZT52C3V3  [SOD-123_L2.7-W1.6-LS3.7-RD-1]  18.3 49.45 0 top
H3  -  [HDR-TH_6P-P2.54-V-F]  39.44 98.02 0 top
H4  -  [HDR-TH_6P-P2.54-V-F]  66.24 98.02 0 top
LED1  WS2812B-4020  [LED-SMD_WS2812B-4020]  76.77 20.13 270 top
LED2  WS2812B-4020  [LED-SMD_WS2812B-4020]  76.71 49.75 270 top
LED4  -  [LED_0402]  20.14 62.04 0 top
LED5  WS2812B-4020  [LED-SMD_WS2812B-4020]  76.71 80.1 270 top
LED6  WS2812B-4020  [LED-SMD_WS2812B-4020]  28.7 19.65 90 top
LED7  WS2812B-4020  [LED-SMD_WS2812B-4020]  28.7 49.62 90 top
LED8  WS2812B-4020  [LED-SMD_WS2812B-4020]  28.7 79.59 90 top
LED9  FM-B2020RGBA-HG  [LED-SMD_FM-B2020RGBA-HG]  2.97 56.1 180 top
OSC1  8MHz  [OSC-SMD_4P-L3.2-W2.5-BL-1]  15.7 62.98 180 top
Q1  -  [SOT-23-3_L2.9-W1.3-P1.90-LS2.4-BR]  38.23 29.17 180 bottom
Q2  -  [SOT-23-3_L2.9-W1.3-P1.90-LS2.4-BR]  36.32 34.12 180 bottom
Q3  -  [SOT-23-3_L2.9-W1.3-P1.90-LS2.4-BR]  33.78 39.71 180 bottom
R1  50R  [R0603]  41.53 28.41 90 bottom
R2  5.1K  [R0603]  65.91 27.65 0 top
R3  50R  [R0603]  39.88 34.12 90 bottom
R4  10K  [R0402]  8.18 61.48 180 top
R5  50R  [R0603]  37.08 39.84 90 bottom
R6  5.1K  [R0603]  65.79 87.46 0 top
R52  10K  [R0402]  20.01 60.79 180 top
R75  10K  [R0603]  17.32 58.41 180 bottom
R87  10R  [R0402]  6.45 53.1 0 top
R112  10K  [R0402]  9.88 12.79 315 top
R113  10K  [R0402]  11.38 11.29 315 top
R114  5.1K  [R0603]  1.8 52.21 180 top
R115  5.1K  [R0603]  1.91 39.46 0 top
R116  5.1K  [R0603]  66.15 57.76 0 top
R117  10K  [R0603]  12.57 48.48 180 top
R119  10K  [R0402]  5.79 56.5 0 top
R120  10K  [R0402]  2.92 54.17 0 top
R121  10K  [R0402]  5.79 57.67 0 top
R122  5.1K  [R0603]  63.65 58.64 270 top
R123  5.1K  [R0603]  63.35 88.28 270 top
R124  5.1K  [R0603]  63.3 28.54 270 top
RXA1  -  [LED-TH_BD5.0-P2.54-RD]  65.77 16.82 0 top
RXA2  -  [LED-TH_BD5.0-P2.54-RD]  65.77 46.82 0 top
RXA3  -  [LED-TH_BD5.0-P2.54-RD]  65.77 76.82 0 top
RXB1  -  [LED-TH_BD5.0-P2.54-RD]  65.77 23.17 0 top
RXB2  -  [LED-TH_BD5.0-P2.54-RD]  65.77 53.17 0 top
RXB3  -  [LED-TH_BD5.0-P2.54-RD]  65.77 83.17 0 top
SCREW1  -  [M2螺丝]  28.94 98 0 top
SCREW2  -  [M2螺丝]  49.94 98 0 top
SCREW3  -  [M2螺丝]  28.94 2 0 top
SCREW4  -  [M2螺丝]  49.94 2 0 top
SCREW5  -  [M2螺丝]  55.74 98 0 top
SCREW6  -  [M2螺丝]  76.74 98 0 top
SCREW7  -  [M2螺丝]  55.74 2 0 top
SCREW8  -  [M2螺丝]  76.74 2 0 top
SW2  KEY-3*4*2  [SW-SMD_L4.0-W2.9-LS5.0]  4.6 59.93 0 top
TXA1  -  [LED-TH_BD5.0-P2.54-FD]  39.58 23.3 0 top
TXA2  -  [LED-TH_BD5.0-P2.54-FD]  39.58 46.7 0 top
TXA3  -  [LED-TH_BD5.0-P2.54-FD]  39.58 83.3 0 top
TXB1  -  [LED-TH_BD5.0-P2.54-FD]  39.58 16.7 0 top
TXB2  -  [LED-TH_BD5.0-P2.54-FD]  39.58 53.3 0 top
TXB3  -  [LED-TH_BD5.0-P2.54-FD]  39.58 76.7 0 top
U1  STM32G431CBU6  [UFQFPN-48_L7.0-W7.0-P0.50-BL-EP]  13.26 55.83 180 top
U12  XY-ZH1.5-6A61  [CONN-SMD_6P-P1.50_XY-ZH1.5-6A61]  4.83 6.95 270 top
U16  TLV76733DRVT  [WSON-6_L2.0-W2.0-P0.65-TL-EP]  17.69 43.4 270 top
U17  GH1.25-3P卧贴  [CONN-SMD_GH1.25-3P]  4.19 95.59 270 top
U39  TVS_5CA  [SMA_L4.3-W2.7-LS5.0-BI]  12.57 45.68 0 top
U40  TypeC-16PIN  [USB-C-SMD_TYPE-C-6PIN-2MD-073]  4.32 45.81 270 top
U43  -  [5P_pcb接口-2.54mm]  40.69 1.9 0 top
U54  BX-ZH1.5-9PZZ  [CONN-TH_9P-P1.50_ZH-1.5]  39.47 7.29 0 top
U55  BX-ZH1.5-9PZZ  [CONN-TH_9P-P1.50_ZH-1.5]  66.27 7.29 0 top
U56  -  [5P_pcb接口-2.54mm]  67.49 1.9 0 top
U57  BX-ZH1.5-9PZZ  [CONN-TH_9P-P1.50_ZH-1.5]  17.27 1.74 0 top
U58  BX-ZH1.5-9PZZ  [CONN-TH_9P-P1.50_ZH-1.5]  17.27 98.26 180 top
U59  GH1.25-2P卧贴  [CONN-SMD_2P-P1.25_GH1.25-2P]  4.32 88.1 270 top

## Footprints (pads in the part's own frame, mm; a bottom-side part is the same pattern mirrored in y, then rotated)
5P_pcb接口-2.54mm
  custom 2.032x2.54 smd: 1(-7.62,0.051) 2(-5.08,0.051) 3(-2.54,0.051) 4(0,0.051) 5(2.54,0.051) 6(5.08,0.051)
C0402
  rect 0.79x0.54 smd: 1(-0.545,0) 2(0.545,0)
c0402_new
  rect 0.79x0.54 smd: 1(-0.545,0) 2(0.545,0)
CONN-SMD_2P-P1.25_GH1.25-2P
  rect 0.6x1.7 smd: 1(-0.625,1.702) 2(0.625,1.702)
  rect 1x2.7 smd: 3(2.475,-1.702) 4(-2.475,-1.698)
CONN-SMD_6P-P1.50_XY-ZH1.5-6A61
  rect 0.7x2.6 smd: 1(-3.75,1.825) 2(-2.25,1.825) 3(-0.75,1.825) 4(0.75,1.825) 5(2.25,1.825) 6(3.75,1.825)
  rect 1.1x1.9 smd: 7(5.7,-1.825) 8(-5.7,-1.825)
CONN-SMD_GH1.25-3P
  rect 0.6x1.7 smd: 1(-1.282,1.675) 2(-0.032,1.675) 3(1.218,1.675)
  rect 1x2.8 smd: 4(-3.132,-1.675) 5(3.132,-1.675)
CONN-TH_9P-P1.50_ZH-1.5
  round 1.1 hole 0.7: 1(-6,0.013) 2(-4.5,0.013) 3(-3,0.013) 4(-1.5,0.013) 5(0,0.013) 6(1.5,0.013) 7(3,0.013) 8(4.5,0.013) 9(6,-0.013)
HDR-TH_6P-P2.54-V-F
  rect 1.8x1.6 hole 1.02: 1(-6.35,0)
  round 1.6 hole 1.02: 2(-3.81,0) 3(-1.27,0) 4(1.27,0) 5(3.81,0) 6(6.35,0)
LED-SMD_FM-B2020RGBA-HG
  rect 0.8x0.7 smd: 1(-0.85,0.55) 2(0.85,0.55) 3(0.85,-0.55) 4(-0.85,-0.55)
LED-SMD_WS2812B-4020
  rect 0.42x1.3 smd: 1(1.275,0) 2(0.425,0) 3(-0.425,0) 4(-1.275,0)
LED-TH_BD5.0-P2.54-FD
  round 1.6 hole 1: 1(-1.27,0) 2(1.27,0)
LED-TH_BD5.0-P2.54-RD
  rect 1.2x1.2 hole 0.72: 1(1.27,0)
  round 1.2 hole 0.72: 2(-1.27,0)
LED_0402
  rect 0.637x0.541 smd: 1(-0.538,0) 2(0.538,0)
M2螺丝
  round 2 hole 2: 1(0,0)
OSC-SMD_4P-L3.2-W2.5-BL-1
  rect 1.4x1.2 smd: 1(-1.1,-0.8) 2(1.1,-0.8) 3(1.1,0.8) 4(-1.1,0.8)
R0402
  rect 0.566x0.54 smd: 1(-0.433,0) 2(0.433,0)
R0603
  rect 0.806x0.864 smd: 1(-0.753,0) 2(0.753,0)
SMA_L4.3-W2.7-LS5.0-BI
  rect 2x1.8 smd: 1(-2.35,0) 2(2.35,0)
SOD-123_L2.7-W1.6-LS3.7-RD-1
  rect 1.2x0.95 smd: 1(-1.7,0) 2(1.7,0)
SOT-23-3_L2.9-W1.3-P1.90-LS2.4-BR
  rect 1.25x0.7 smd: 1(1,-0.95) 2(1,0.95) 3(-1,0)
SW-SMD_L4.0-W2.9-LS5.0
  rect 1.53x1.36 smd: 1(-2.035,0) 2(2.035,0)
UFQFPN-48_L7.0-W7.0-P0.50-BL-EP
  oval 0.28x0.9 smd: 1(-2.751,-3.45) 2(-2.251,-3.45) 3(-1.75,-3.45) 4(-1.25,-3.45) 5(-0.749,-3.45) 6(-0.249,-3.45) 7(0.249,-3.45) 8(0.75,-3.45) 9(1.25,-3.45) 10(1.75,-3.45) 11(2.251,-3.45) 12(2.751,-3.45) 25(2.751,3.449) 26(2.251,3.449) 27(1.75,3.449) 28(1.25,3.449) 29(0.75,3.449) 30(0.249,3.449) 31(-0.249,3.449) 32(-0.749,3.449) 33(-1.25,3.449) 34(-1.75,3.449) 35(-2.251,3.449) 36(-2.751,3.449)
  oval 0.9x0.28 smd: 13(3.45,-2.751) 14(3.45,-2.251) 15(3.45,-1.75) 16(3.45,-1.25) 17(3.45,-0.75) 18(3.45,-0.249) 19(3.45,0.249) 20(3.45,0.749) 21(3.45,1.25) 22(3.45,1.75) 23(3.45,2.251) 24(3.45,2.751) 37(-3.449,2.751) 38(-3.449,2.251) 39(-3.449,1.75) 40(-3.449,1.25) 41(-3.449,0.749) 42(-3.449,0.249) 43(-3.449,-0.249) 44(-3.449,-0.75) 45(-3.449,-1.25) 46(-3.449,-1.75) 47(-3.449,-2.251) 48(-3.449,-2.751)
  rect 5.5x5.5 smd: 49(0,0)
USB-C-SMD_TYPE-C-6PIN-2MD-073
  rect 0.55x1.1 smd: 1(-3.2,2.375) 2(-2.4,2.375) 11(2.4,2.375) 12(3.2,2.375)
  rect 0.3x1.1 smd: 3(-1.75,2.375) 4(-1.25,2.375) 5(-0.75,2.375) 6(-0.25,2.375) 7(0.25,2.375) 8(0.75,2.375) 9(1.25,2.375) 10(1.75,2.375)
  oval 1.1x2 hole 0.6x1.5: 13(-4.325,1.825) 14(4.325,1.825)
  oval 1.2x1.8 hole 0.6x1.2: 13(-4.325,-2.375) 14(4.325,-2.375)
WSON-6_L2.0-W2.0-P0.65-TL-EP
  oval 0.607x0.364 smd: 1(-1.028,0.65) 2(-1.028,0) 3(-1.028,-0.65) 4(1.028,-0.65) 5(1.028,0) 6(1.028,0.65)
  rect 1x1.6 smd: 7(0,0)

## Nets
As in the schematic.

Pads without a net: OSC1 1; SCREW1 1; SCREW2 1; SCREW3 1; SCREW4 1; SCREW5 1; SCREW6 1; SCREW7 1; SCREW8 1; U1 2 3 4 12 13 14 18 19 26 29 31 32 47; U17 4 5; U40 3 9 13 14; U59 3 4

## Via types
v1: diameter 0.508, hole 0.305, Top Layer to Bottom Layer, 148 vias
v2: diameter 0.61, hole 0.305, Top Layer to Bottom Layer, 11 vias

## Routing (per net, layer and track width the routed paths; a pad name or vN(x,y) marks a point on that pad's centre or on a via; arc(x,y) is an arc through that point)
5V: length 571.4
  Top Layer w0.152: U16.4 17.04,41.98 17.3,41.72 18.34,41.72
  Top Layer w0.203: U57.9 24.33,2.79 24.33,16.73 24.82,17.21 27.28,17.21 27.58,16.9 29.08,16.9 v1(30.71,18.53)
  Top Layer w0.254: v1(34.38,39.71) 30.78,39.71 30.73,39.67 ; H4.5 68.8,99.28 66.8,99.28 66.29,98.77 66.29,87.71 R6.2 65.79,86.71 65.79,59.78 66.68,58.89 66.68,57.99 R116.2 66.9,55.94 65.79,54.83 65.79,29.93 66.67,29.05 R2.2 66.67,26.13 v2(66.68,26.12) ; 30.73,20.92 29.97,20.16 28.78,20.16 28.7,20.07 ; LED7.2 29.89,50.04 30.73,50.89 30.73,78.76 29.48,80.02 LED8.2 ; v1(38.81,29.15) 38.74,29.08 30.73,29.08 ; 75.06,19.01 75.06,48.6 ; 75.06,19.01 75.06,12.28 70.77,7.99 U55.8 70.74,7.28 70.74,4.91 70.03,4.2 v1(70.03,1.95) ; 75.06,19.01 75.69,19.65 76.71,19.65 LED1.2 ; 75.06,48.6 75.69,49.24 76.62,49.24 LED2.2 ; 75.06,48.6 75.06,78.96 75.69,79.59 76.62,79.59 LED5.2 ; 30.73,34.15 30.76,34.12 v1(36.98,34.12)
  Top Layer w0.381: 10.1,45.68 10.1,45.62 v1(9.73,45.25) 7.89,43.41 U40.11 ; U57.9 23.27,2.27 22.34,3.2 U12.6 1.79,3.2 0.79,4.2 0.79,35.34 5.03,39.59 6.76,39.59 10.22,43.05 U39.1 v1(10.63,45.28) 15.05,40.86 18.25,40.86 C39.2 18.34,40.94 U16.6 ; U54.9 45.77,6.99 v1(45.77,1.95) ; v1(30.71,18.53) 30.73,18.55 30.73,50.89
  Bottom Layer w0.254: U55.8 70.77,7.68 65.91,12.53 65.91,25.11 66.68,25.87 v2(66.68,26.12)
  Bottom Layer w0.381: U58.8 12.65,98.12 12.65,97.32 11.12,95.8 5.84,95.8 3.89,93.84 3.89,48.5 4.85,47.54 5.95,47.54 6.79,48.37 8.28,48.37 9.75,46.9 v1(9.75,46.06) ; v1(30.71,18.53) 30.68,18.5 30.68,7.96 33.05,5.6 43.79,5.6 U54.9 48.26,10.07 48.26,95.56 H3.6
  vias: v1(10.64,46.09) v1(45.21,2.78) v1(45.21,1.16) v1(46.34,2.78) v1(46.34,1.16) v1(69.42,2.83) v1(69.44,1.05) v1(70.68,2.83) v1(70.68,1.05)
GND: length 366
  Top Layer w0.203: 41.15,46.99 50.29,56.14 50.29,61.58 51.08,62.37 56.03,62.37 v1(56.19,62.22) ; 23.86,61.92 24.03,62.09 28.57,62.09 28.7,62.22
  Top Layer w0.254: RXB3.1 68.33,84.46 68.33,97.21 H4.4 ; RXB3.1 68.84,81.37 76.71,81.37 ; RXB3.1 RXA3.1 68.45,75.41 68.45,55.46 67.04,54.05 RXB2.1 RXA2.1 67.04,30.84 68.33,29.55 68.33,24.46 RXB1.1 RXA1.1 67.04,9.54 69.27,7.31 69.27,5.6 67.49,3.82 v1(67.49,1.95) ; LED7.4 v2(28.7,47.59) ; 41.15,46.99 TXA2.2 41.28,46.28 41.28,42.25 38.35,39.33 38.35,31.97 40.85,29.47 TXA1.2 43.97,20.18 U54.8 43.97,2.69 v1(43.23,1.95) ; v2(75.82,51.02) 76.7,51.02 LED2.4 ; LED8.4 v2(28.7,77.56) ; LED6.4 v2(28.7,17.74)
  Bottom Layer w0.254: H3.5 43.25,97.42 46.99,93.69 46.99,11.52 43.97,8.5 U54.8 ; v2(76.2,21.42) 68.79,21.42 RXB1.1 ; RXB2.1 69.2,51.02 v2(75.82,51.02) ; v2(28.7,17.74) v2(28.7,47.59) v2(28.7,77.56)
  vias: v1(0.96,51.11) v1(1.09,38.34) v1(1.27,59.98) v1(2.56,59.93) v1(4.77,54.24) v1(5.11,52.41) v1(5.1,51.72) v1(6.69,49.01) v1(7.59,42.35) v1(8.61,55.77) v1(10.03,50.2) v1(11.18,54.09) v1(11.37,56.2) v1(11.38,58.08) v1(13.26,58.08) v1(13.26,56.2) v1(13.26,54.09) v1(13.72,64.93) v1(14.6,63.78) v1(14.73,64.93) v1(15.06,58.08) v1(15.08,56.2) v1(15.1,54.09) v1(15.24,50.69) v1(15.57,46.24) v1(15.57,45.68) v1(15.57,45.1) v1(15.7,60.69) v1(15.86,64.93) v1(17.04,43.41) v1(17.63,38.75) v1(17.69,43.4) v1(18.36,62.57) v1(18.3,50.81) v1(18.3,49.45) v1(18.33,43.4) v1(18.41,46.91) v1(42.67,1.1) v1(42.7,2.81) v1(43.83,2.81) v1(43.86,1.1) v1(63.91,69.41) v1(63.91,65.52) v1(63.91,62.16) v1(63.91,59.22) v1(64.06,37.93) v1(64.06,34.63) v1(64.06,31.33) v1(66.9,2.83) v1(66.9,1.08) v1(68.15,2.83) v1(68.15,1.08) v1(75.16,7.07) v1(75.95,14.03) v1(76.43,7.07) v1(77.75,7.1)
VCC3V3: length 131.9
  Top Layer w0.203: v1(9.17,48.53) 8.9,48.8 8.9,49.85 C71.2 ; C71.2 7.7,52.38 7.7,53.25 8,53.56 9.79,53.56 U1.23 ; C71.2 7.03,51.81 6.15,52.69 6.15,53.07 6.04,53.17 ; R4.2 5.28,61.48 4.55,60.74 4.55,59.35 2.12,56.92 LED9.3 1.43,56.65 1.24,56.46 1.24,56.23 ; 11.66,11.01 8.35,7.7 U12.3
  Top Layer w0.254: 17.54,60.3 C73.2 19.42,60.3 ; 17.54,60.3 17.54,61.06 16.37,62.23 16.21,62.23 ; 17.54,60.3 16.76,59.52 ; R112.1 21.26,24.78 21.26,50.56 20.04,51.78 17.73,51.78 16.98,51.03 C74.2 16.98,49.84 D26.1 15.53,49.45 v2(15.49,49.49) 14.34,49.49 R117.1 ; v1(21.06,58.66) 19.42,60.3 ; 19.42,60.3 19.42,60.35 19.58,60.52 R52.2 ; 16.8,51.02 16.67,51.14 16.08,51.14 15.51,51.71 U1.35 ; 16.76,59.52 16.76,58.63 U1.48 ; 16.76,59.52 16.26,59.52 U1.1 ; 6.04,53.17 2.11,53.17 1.24,54.04 1.24,56.23
  Top Layer w0.381: U16.1 U16.2 17.69,45.14 17.4,45.43 17.4,47.65 16.6,48.45 D26.1 ; R112.1 8.53,12.05 5.21,12.05 4.47,11.32 4.47,8.34 5.12,7.7 U12.3
  Bottom Layer w0.254: v2(15.49,49.49) 18.52,52.51 18.52,53.33 21.06,55.87 v1(21.06,58.66) ; v1(13.31,48.47) 9.23,48.47 v1(9.17,48.53)
AIRTX1: length 95.8
  Top Layer w0.203: v1(19.25,53.02) 18.19,54.09 16.72,54.09 U1.39
  Top Layer w0.254: U54.2 35.18,7.1 35.18,2.38 v1(35.61,1.95)
  Bottom Layer w0.203: U57.2 19.25,8.23 v1(19.25,53.02)
  Bottom Layer w0.254: U54.2 34.8,7.48 34.8,8.34 33.27,9.87 33.27,19.27 31.75,20.79 31.75,37.73 Q3.1
  vias: v1(34.95,2.78) v1(34.95,1.1) v1(36.19,2.78) v1(36.19,1.1)
AIRTX2: length 91.8
  Top Layer w0.203: U1.40 16.72,54.57 19.02,54.57 v1(19.99,53.61)
  Top Layer w0.254: v1(38.15,1.95) 38.15,4.23 36.58,5.8 36.58,7.2 U54.3
  Bottom Layer w0.203: U57.3 14.29,1.75 19.99,7.45 v1(19.99,53.61)
  Bottom Layer w0.254: Q2.1 33.53,31.38 33.53,20.92 34.54,19.9 34.54,10.12 36.47,8.19 U54.3
  vias: v1(37.57,2.81) v1(37.57,1.13) v1(38.73,2.81) v1(38.73,1.13)
AIRTX3: length 88
  Top Layer w0.203: v1(20.78,54.24) 19.96,55.05 16.73,55.05 U1.41
  Top Layer w0.254: U54.4 37.97,6.06 40.26,3.77 40.26,2.38 v1(40.69,1.95)
  Bottom Layer w0.203: U57.4 17.38,3.37 17.58,3.37 20.78,6.57 v1(20.78,54.24)
  Bottom Layer w0.254: U54.4 37.97,8.09 35.81,10.25 35.81,26.76 37.23,28.17 Q1.1
  vias: v1(40.11,2.81) v1(40.08,1.13) v1(41.24,2.81) v1(41.24,1.13)
AIRTX4: length 155.8
  Top Layer w0.203: v1(21.46,54.85) 20.73,55.59 16.72,55.59 U1.42
  Bottom Layer w0.203: v1(21.46,54.85) 21.72,54.6 21.72,6.2 U57.5
  Bottom Layer w0.254: U54.5 39.47,8.7 43.56,12.79 43.56,90.07 35.63,98
AIRTX5: length 156
  Top Layer w0.203: U1.43 21.56,56.07 v1(22.12,55.51)
  Bottom Layer w0.203: U57.6 22.61,5.59 22.61,55.03 v1(22.12,55.51)
  Bottom Layer w0.254: 38.17,98 44.58,91.6 44.58,12.28 40.97,8.68 U54.6
AIRTX6: length 156.3
  Top Layer w0.203: v1(22.12,56.65) 22.1,56.63 16.77,56.63 U1.44
  Bottom Layer w0.203: v1(22.12,56.65) 23.39,55.38 23.39,4.87 U57.7
  Bottom Layer w0.254: U54.7 42.47,8.53 45.72,11.77 45.72,92.99 40.71,98
IRRX1: length 132.8
  Top Layer w0.203: U1.8 12.57,59.34 v1(12.57,60.92)
  Top Layer w0.254: v1(59.87,1.95) 60.27,2.35 U55.1 60.27,72.59 RXA3.2 RXB3.2 64.5,86.93 R6.1 63.41,87.46 R123.2
  Bottom Layer w0.203: U58.1 23.27,78.86 12.57,68.16 v1(12.57,60.92)
  vias: v1(59.21,2.83) v1(59.2,1.1) v1(60.52,2.83) v1(60.53,1.1)
IRRX2: length 102.6
  Top Layer w0.203: U1.9 12.01,62.12 v1(11.81,62.32)
  Top Layer w0.254: R122.2 63.77,57.76 R116.1 64.5,56.87 RXB2.2 RXA2.2 61.77,44.09 U55.2 61.72,7.26 61.72,4.79 62.41,4.1 v1(62.41,1.95)
  Bottom Layer w0.203: U58.2 21.77,78.88 11.81,68.92 v1(11.81,62.32)
  vias: v1(61.85,2.83) v1(61.86,1.12) v1(63.01,2.83) v1(63.01,1.12)
IRRX3: length 72.1
  Top Layer w0.203: v1(11.05,61.43) 11.51,60.97 U1.10
  Top Layer w0.254: R124.2 63.43,27.65 R2.1 64.5,26.99 RXB1.2 RXA1.2 63.27,15.59 U55.3 63.25,7.28 63.25,5.68 64.95,3.98 v1(64.95,1.95)
  Bottom Layer w0.203: v1(11.05,61.43) 11.05,70.07 20.27,79.29 U58.3
  vias: v1(64.36,2.83) v1(64.34,1.09) v1(65.53,2.83) v1(65.53,1.09)
IRRX4: length 135.9
  Top Layer w0.203: v1(10.19,60.54) 11.01,59.71 U1.11
  Bottom Layer w0.203: v1(10.19,60.54) 10.19,70.98 18.77,79.57 U58.4
  Bottom Layer w0.254: H4.1 59.56,97.7 59.56,12.51 U55.4
IRRX5: length 146.1
  Top Layer w0.203: v1(10.13,51.5) 11.18,51.5 11.51,51.83 U1.27
  Bottom Layer w0.203: U58.5 17.27,80.35 9.27,72.35 9.27,54.83 10.13,53.96 v1(10.13,51.5)
  Bottom Layer w0.254: U55.5 66.27,7.48 60.83,12.92 60.83,94.7 62.43,96.3 H4.2
IRRX6: length 145.7
  Top Layer w0.203: U1.25 10.29,52.16 8.69,52.16 8.25,52.59 v1(8.25,53)
  Bottom Layer w0.203: U58.6 15.77,80.88 8.05,73.16 8.05,53.2 v1(8.25,53)
  Bottom Layer w0.254: U55.6 67.77,8.14 62.1,13.8 62.1,93.81 64.97,96.68 64.97,98.02
LED_IN: length 40.7
  Top Layer w0.254: LED6.1 29.84,20.92 v2(29.84,20.92) ; v1(72.57,1.95) 72.57,4.23 72.26,4.53 72.26,7.28 U55.9 76.77,11.78 LED1.1 ; U54.1 33.47,2.35 v1(33.07,1.95)
  Bottom Layer w0.254: U54.1 32.13,8.65 32.13,18.63 v2(29.84,20.92)
  vias: v1(32.51,2.76) v1(32.51,1.23) v1(33.71,2.78) v1(33.7,1.23) v1(71.96,2.86) v1(71.95,1.05) v1(73.17,2.86) v1(73.17,1.05)
LED_IN_1: length 51.1
  Top Layer w0.152: U1.28 12.01,51.96 v1(12.93,51.04)
  Bottom Layer w0.203: v1(7.54,4.71) 13.97,11.14 13.97,50 v1(12.93,51.04)
LED_IN_2: length 52.9
  Top Layer w0.152: 13.01,52.38 13.01,51.95 v1(13.46,51.5)
  Bottom Layer w0.203: v1(13.46,51.5) 14.91,50.05 14.91,5.39 U57.1
LED_IN_3: length 40.1
  Top Layer w0.152: v1(13.11,92.9) 13.11,96.44 U58.9 ; v1(13.11,88.48) 12.88,88.25 12.88,63.46 13.54,62.8 13.54,59.3 13.51,59.27
  Bottom Layer w0.152: v1(13.11,88.48) v1(13.11,92.9)
LED_OUT: length 43
  Top Layer w0.254: H3.1 33.09,87.03 27.56,81.5 27.56,79.59 27.98,79.17 28.7,79.17 ; 72.59,98.02 78.1,92.51 78.1,80.99 77.64,80.52 LED5.3
MPR_SCL: length 54.4
  Top Layer w0.203: U1.38 16.78,53.5 17.75,53.5 18.9,52.36 20.75,52.36 22.17,50.94 22.17,24.19 8.68,10.7 U12.1
MPR_SDA: length 62
  Top Layer w0.203: U1.45 18.43,57.08 18.67,57.31 22.45,57.31 23.09,56.68 23.09,23.94 8.35,9.2 U12.2
NRST: length 12.4
  Top Layer w0.203: 13.01,59.27 13.01,60.07 13.13,60.19 13.13,62.37 12.67,62.83 C3.2 8.77,61.64 R4.1 8.61,60.34 8.23,59.96 6.66,59.96 SW2.2
RGB1: length 3.8
  Top Layer w0.203: R119.2 6.24,56.49 6.59,56.49 7.14,57.04 9.77,57.04 U1.16
RGB2: length 7.5
  Top Layer w0.203: R120.2 3.86,54.17 5.56,55.87 6.71,55.87 7.42,56.58 9.81,56.58 U1.17
RGB3: length 3.6
  Top Layer w0.203: U1.15 9.81,57.57 6.33,57.57 R121.2
SWDCLK: length 52.1
  Top Layer w0.203: U17.2 7.41,95.62 16.05,86.98 16.05,69.63 v1(16.84,68.85) ; v1(17.47,52.54) 17.25,52.54 U1.37
  Bottom Layer w0.203: v1(17.47,52.54) 17.98,53.05 17.98,53.81 20.22,56.04 20.22,65.47 v1(16.84,68.85)
SWDIO: length 54.2
  Top Layer w0.203: v1(16.97,70.83) 16.97,87.29 7.38,96.87 U17.1 ; U1.36 16.33,52.06 v1(16.74,52.06)
  Bottom Layer w0.203: v1(16.97,70.83) 15.88,69.74 15.88,68.01 19.41,64.48 19.41,56.3 16.74,53.63 v1(16.74,52.06)
UART_RX: length 41.3
  Top Layer w0.203: v1(8.69,54.06) 9.8,54.06 U1.22
  Bottom Layer w0.203: v1(8.69,54.06) 9.6,53.15 9.6,52.57 8.97,51.93 7.73,51.93 6.17,53.49 v1(6.17,87.46)
UART_TX: length 39.7
  Top Layer w0.203: U1.24 9.22,53.07 v1(8.97,52.82)
  Bottom Layer w0.203: v1(6.08,88.67) 6.82,88.67 7.11,88.38 7.11,53.25 7.95,52.41 8.79,52.41 8.97,52.59 v1(8.97,52.82)
USB_DM: length 13.8
  Top Layer w0.152: U1.33 14.51,51.81 12.6,49.9 11.83,49.9 10.72,48.79 10.72,47.87 10.31,47.46 8.86,47.46 7.96,46.56 U40.5 5.96,46.56 5.72,46.32 5.72,45.76 5.92,45.55 6.69,45.55 U40.7
USB_DP: length 13.7
  Top Layer w0.152: 7.37,46.06 6.7,46.06 U40.6 ; 7.37,46.06 7.62,45.81 7.62,45.3 7.38,45.06 U40.8 ; 7.37,46.06 7.87,46.06 8.99,47.18 10.52,47.18 R117.2 11.63,48.66 11.63,49 12.2,49.57 12.78,49.57 15.01,51.8 U1.34
$1N922: length 3.3
  Top Layer w0.203: U1.5 14.01,61.7 14.54,62.23 14.6,62.18
$1N942: length 1.8
  Top Layer w0.203: U1.46 17.29,57.58 v1(18.12,58.41)
$1N1007: length 5
  Top Layer w0.254: U1.20 9.81,54.83 ; 9.81,54.83 10.16,54.83 ; 9.81,54.83 U1.21 ; 9.81,54.83 7.53,54.83 C75.2 6.91,54.21 6.91,53.17
$1N2453: length 1.2
  Top Layer w0.254: 20.68,60.84 LED4.2
$1N3583: length 10.2
  Top Layer w0.152: U40.4 7.47,47.06 7.87,47.46 7.87,50.15 7.06,50.96 3.8,50.96 R114.1
$1N3584: length 9.8
  Top Layer w0.203: U40.10 7.44,44.06 v1(7.9,44.51)
  Bottom Layer w0.203: v1(7.9,44.51) 6.02,44.51 4.42,42.91 4.42,40.93 3,39.51 2.77,39.51 v1(2.74,39.48)
$1N5577: length 4.7
  Bottom Layer w0.254: Q1.2 40.57,30.12 R1.2
$1N5585: length 4.6
  Bottom Layer w0.254: Q2.2 39.68,35.07 R3.2
$1N5593: length 4.3
  Bottom Layer w0.254: R5.2 37.01,40.66 Q3.2
$1N7163: length 29.6
  Top Layer w0.254: LED2.1 78.1,47.07 78.1,20.92 77.72,20.54 76.79,20.54 LED1.3
$1N7164: length 30.3
  Top Layer w0.254: LED2.3 77.51,50.17 78.1,50.76 78.1,77.43 LED5.1
$1N7689: length 33.6
  Top Layer w0.254: LED7.1 28.7,50.89 27.81,50.89 27.56,50.63 27.56,19.65 27.98,19.22 LED6.3
$1N7690: length 33.8
  Top Layer w0.254: 29.97,49.24 v2(29.84,49.24) 28.75,49.24 LED7.3 ; v2(29.34,80.86) 29.33,80.87 28.7,80.87
  Bottom Layer w0.254: v2(29.84,49.24) 29.84,80.35 v2(29.34,80.86)
$1N11987: length 14.2
  Top Layer w0.254: v2(36.96,20.28) 38.23,19.01 38.23,16.78 TXB1.1
  Bottom Layer w0.254: v2(36.96,20.28) 36.96,24.35 40.27,27.66 R1.1
$1N12080: length 24.4
  Bottom Layer w0.254: R3.1 40.83,33.37 41.99,34.53 41.99,40.27 36.5,45.76 36.5,51.49 TXB2.1
$1N12243: length 41.5
  Bottom Layer w0.254: R5.1 37.8,39.09 38.81,40.09 38.81,41.59 35.25,45.15 35.25,73.64 TXB3.1
$1N23023: length 1.9
  Top Layer w0.203: R119.1 5.28,56.43 5.03,56.43 4.15,55.55 LED9.1
$1N23025: length 1.5
  Top Layer w0.203: LED9.2 2.12,54.53 R120.1
$1N23027: length 2
  Top Layer w0.203: LED9.4 4.8,57.62 5.31,57.62 R121.1
$1N32572: length 7.7
  Top Layer w0.254: TXB2.2 40.85,49.24 TXA2.1
$1N32588: length 7.7
  Top Layer w0.254: TXA1.1 38.31,21.64 40.85,19.1 TXB1.2
$1N32593: length 7.7
  Top Layer w0.254: TXB3.2 40.85,80.76 TXA3.1

## Copper pours and planes (outline as drawn; the poured copper is in the pictures)
5V on Top Layer: 7.24,43.71 6.16,43.71 5.33,44.54 5.33,47.08 6.1,47.84 7.24,47.84 7.37,47.97 7.37,48.48 7.24,48.6 5.47,48.6 4.69,47.82 4.69,44.2 5.85,43.05 7.18,43.05 7.24,43.11
GND on Top Layer: -9.63,105.78 93.12,105.78 93.12,-4.33 -9.63,-4.33
GND on Bottom Layer: -7.47,104.58 93.24,104.58 93.24,-3.95 -7.47,-3.95

## Text on the board
Top Silkscreen Layer: RX | TX

# Board PCB2
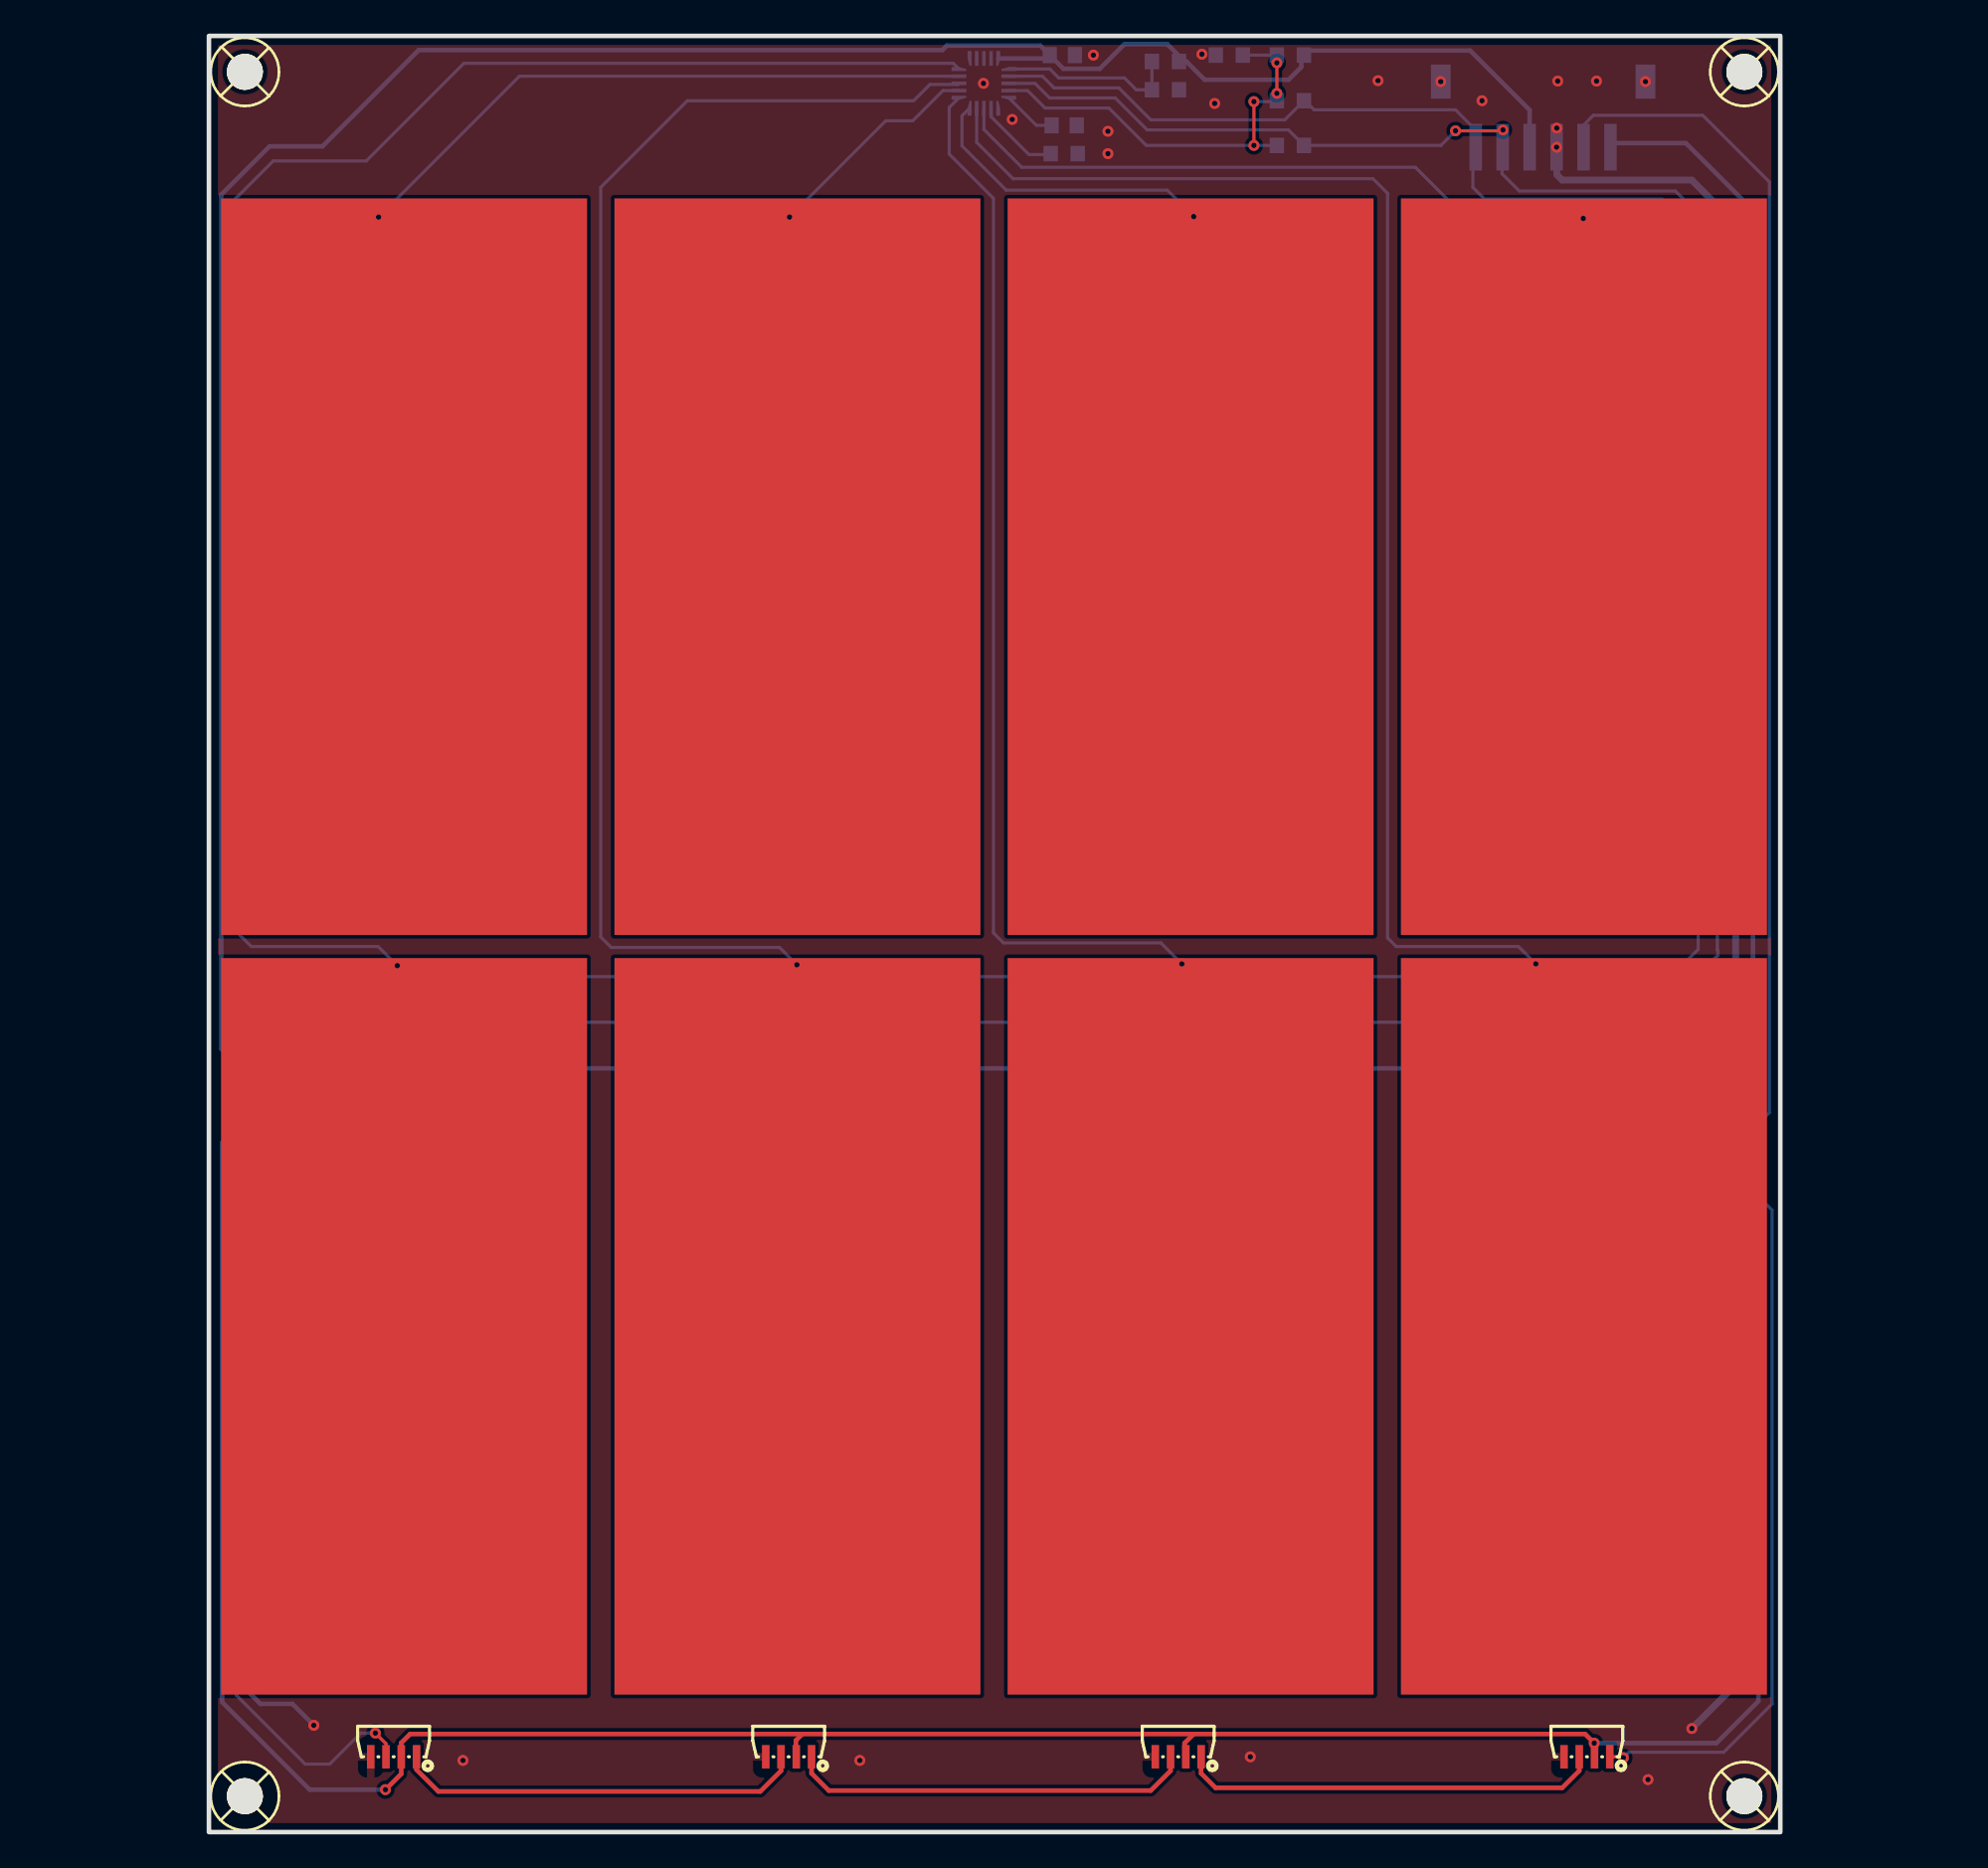
[diagram p4: board, top side]
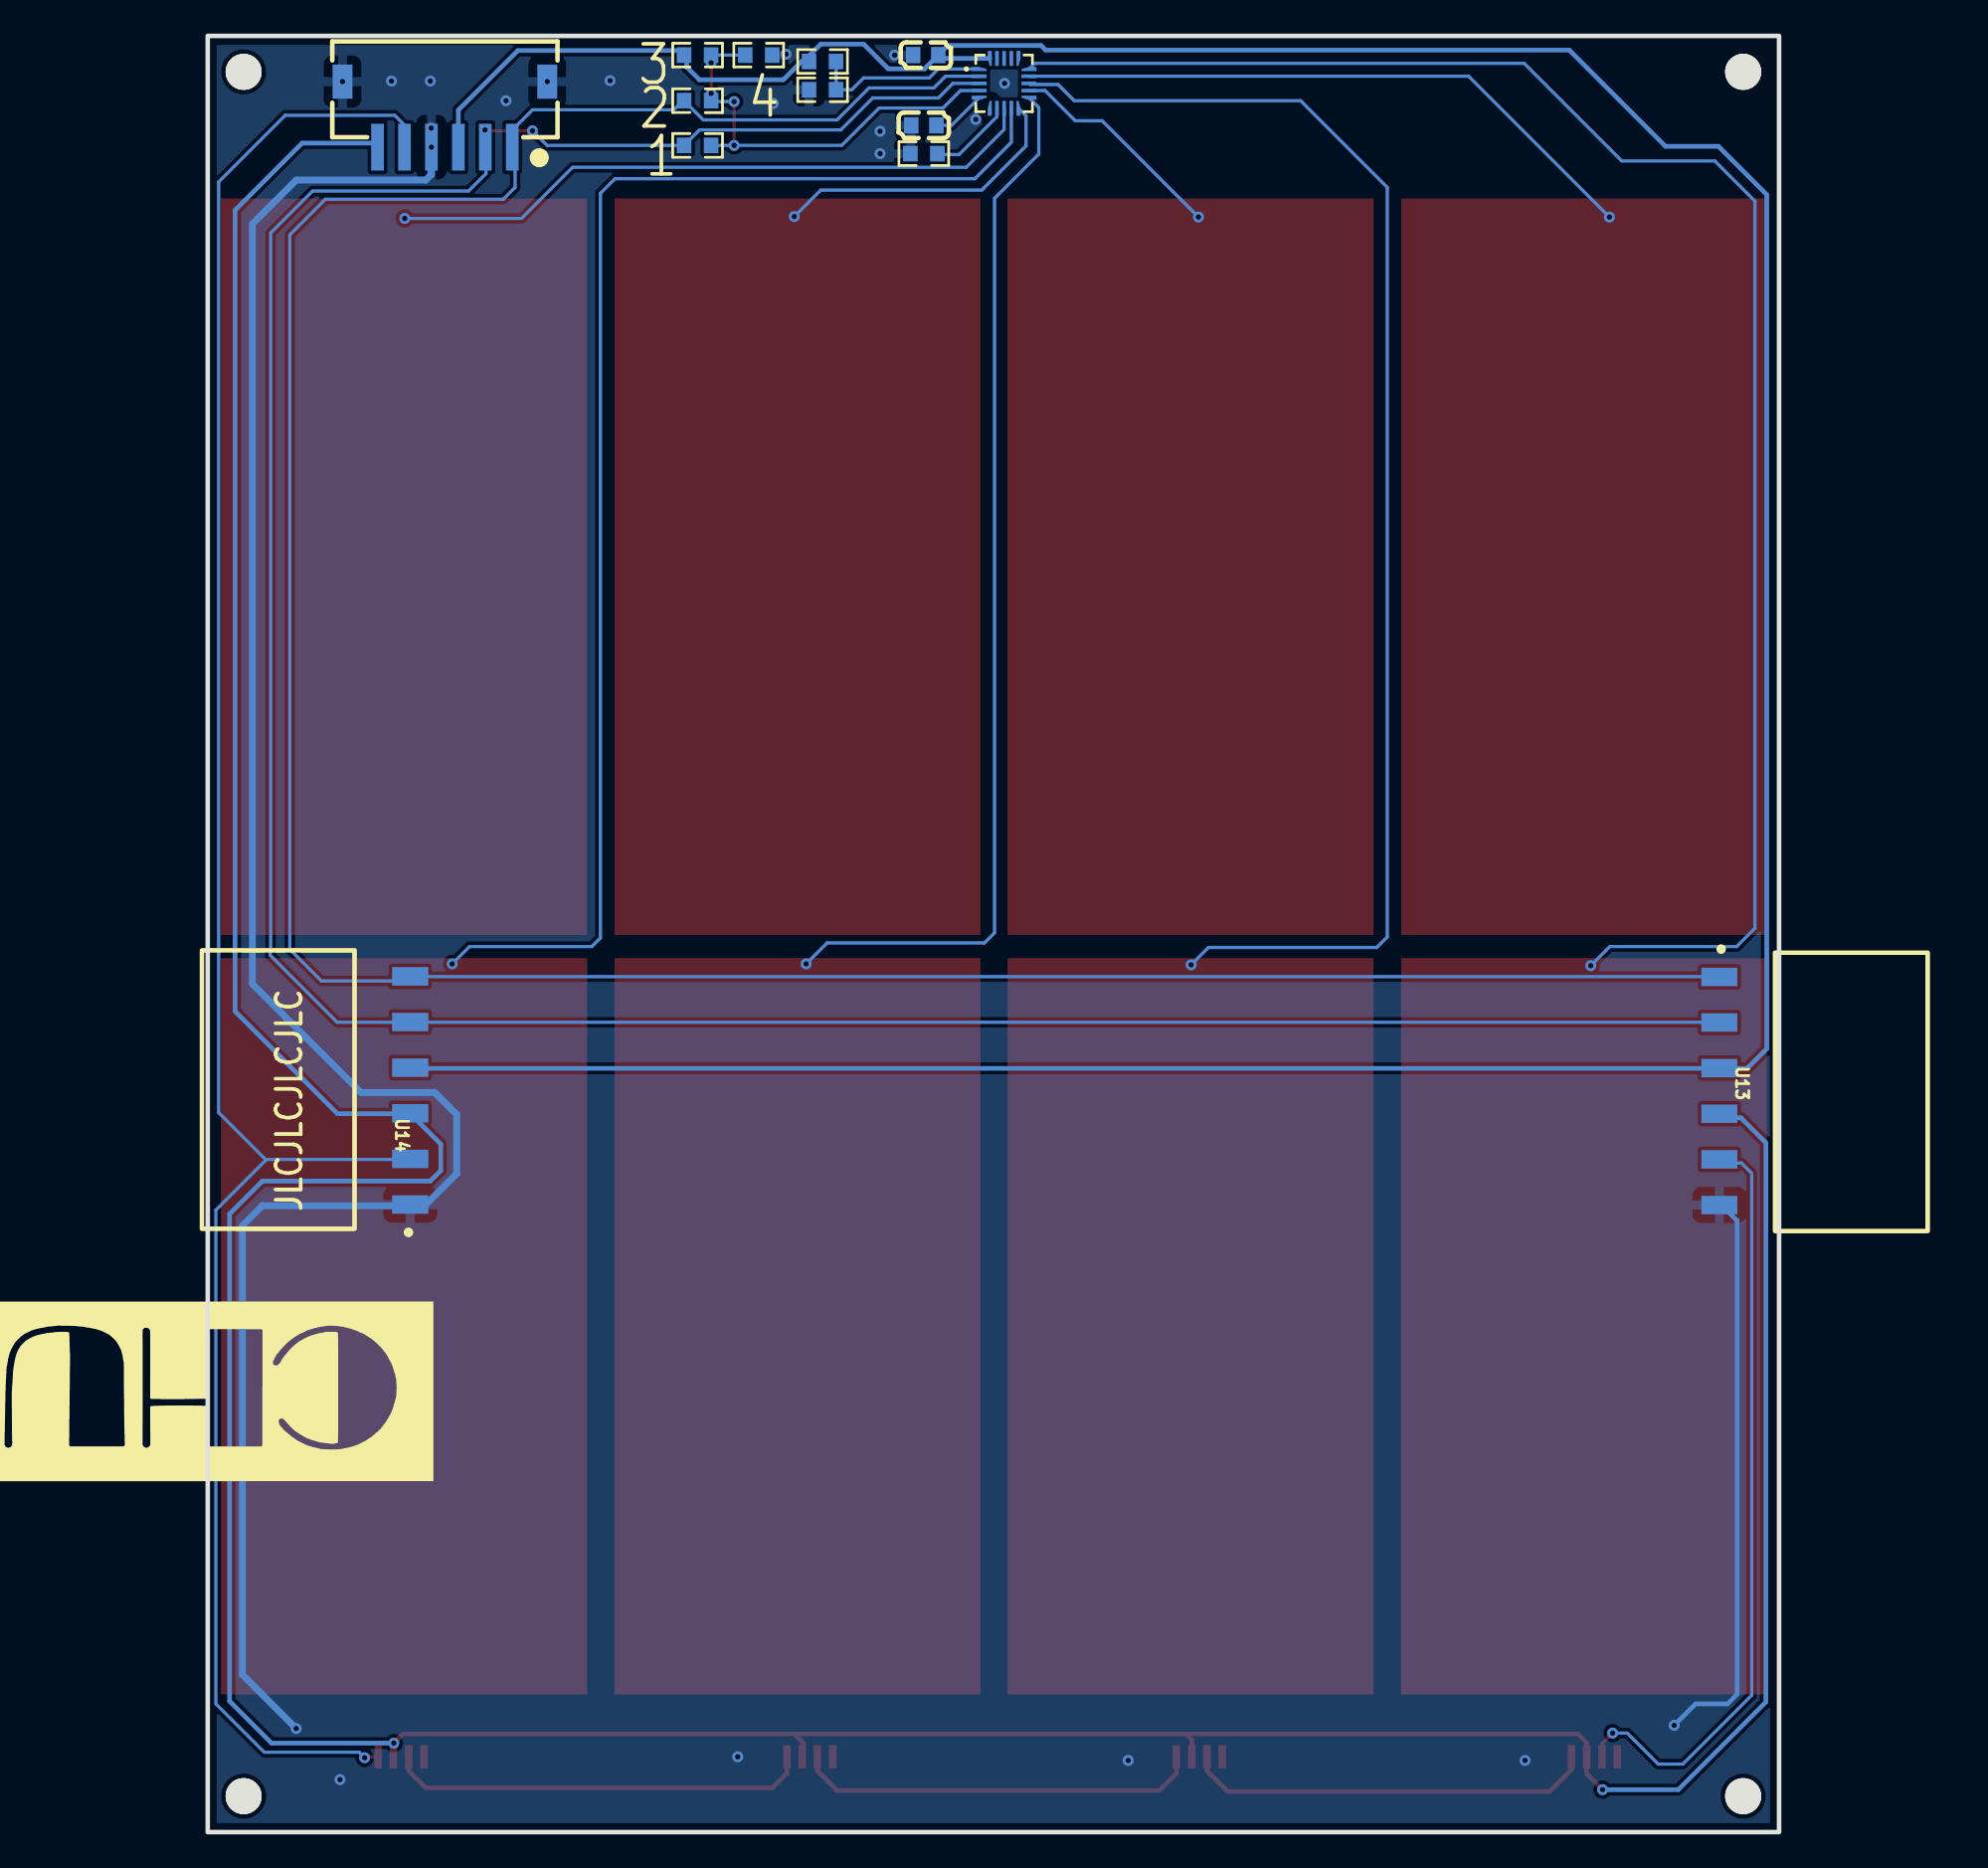
[diagram p5: board, bottom side, seen from below]

Outline 87.5 x 100 mm; copper layers: Top Layer, Bottom Layer. Coordinates in mm from the lower left corner of the outline.
Outline path: rectangle 0,100 87.5,0
Stack: Top Layer 0.035mm / Dielectric1 1.51mm FR4 er 4.5 / Bottom Layer 0.035mm

## Design rules (mm)
template: 自定义配置
spacing copperThickness1oz (default): track to track 0.102, other pairs 0.152 to 0.3
spacing copperThickness2oz: track to track 0.203, other pairs 0.152 to 0.3
track width copperThickness1oz (default): min 0.127, default 0.254, max 2.54
track width copperThickness2oz: min 0.203, default 0.254, max 2.54
differential pair differentialPair (default): width min 0.127, default 0.254, max 2.54; gap min 0.152, default 0.152
via viaSize (default): diameter min 0.5, default 0.61, max 10; hole min 0.3, default 0.305, max 6.3
pour e1172 uses copperRegion1
pour e1277 uses copperRegion1

## Placement (name value [footprint] x y rotation side)
C1  100nF  [C0603]  47.62 95.02 180 bottom
C2  100nF  [C0603]  47.52 98.93 0 bottom
DOWN1  -  [触摸区域-焊盘]  10.87 70.45 0 top
DOWN2  -  [触摸区域-焊盘]  32.77 70.45 0 top
DOWN3  -  [触摸区域-焊盘]  54.66 28.16 0 top
DOWN4  -  [触摸区域-焊盘]  76.57 28.16 0 top
LED1  WS2812B-4020  [LED-SMD_WS2812B-4020]  76.73 4.19 0 top
LED2  WS2812B-4020  [LED-SMD_WS2812B-4020]  53.97 4.19 0 top
LED3  WS2812B-4020  [LED-SMD_WS2812B-4020]  32.28 4.19 0 top
LED4  WS2812B-4020  [LED-SMD_WS2812B-4020]  10.28 4.19 0 top
R1  75K  [R0603]  47.62 93.45 180 bottom
R2  0R  [R0603]  56.82 98.93 180 bottom
R3  0R  [R0603]  60.22 98.93 0 bottom
R4  0R  [R0603]  60.22 93.9 0 bottom
R5  0R  [R0603]  60.22 96.39 0 bottom
R6  10K  [R0603]  53.26 97 180 bottom
R7  10K  [R0603]  53.26 98.58 180 bottom
SCREW5  -  [M2螺丝]  2 2 0 top
SCREW6  -  [M2螺丝]  2 98 0 top
SCREW7  -  [M2螺丝]  85.5 98 0 top
SCREW8  -  [M2螺丝]  85.5 2 0 top
TOP1  -  [触摸区域-焊盘]  10.87 28.16 0 top
TOP2  -  [触摸区域-焊盘]  32.77 28.16 0 top
TOP3  -  [触摸区域-焊盘]  54.66 70.45 0 top
TOP4  -  [触摸区域-焊盘]  76.57 70.45 0 top
U7  -  [QFN-20_L3.0-W3.0-P0.40-BL]  43.15 97.36 270 bottom
U12  XY-ZH1.5-6A61  [CONN-SMD_6P-P1.50_XY-ZH1.5-6A61]  74.29 95.63 0 bottom
U13  2185-106ZG0CYNR1  [HDR-SMD_6P-P2.54-V-F_2185-106ZG0CYNR1]  3.33 41.26 270 bottom
U14  2185-106ZG0CYNR1  [HDR-SMD_6P-P2.54-V-F_2185-106ZG0CYNR1]  76.22 41.29 90 bottom

## Footprints (pads in the part's own frame, mm; a bottom-side part is the same pattern mirrored in y, then rotated)
C0603
  rect 0.8x0.9 smd: 1(-0.7,0) 2(0.7,0)
CONN-SMD_6P-P1.50_XY-ZH1.5-6A61
  rect 0.7x2.6 smd: 1(-3.75,1.825) 2(-2.25,1.825) 3(-0.75,1.825) 4(0.75,1.825) 5(2.25,1.825) 6(3.75,1.825)
  rect 1.1x1.9 smd: 7(5.7,-1.825) 8(-5.7,-1.825)
HDR-SMD_6P-P2.54-V-F_2185-106ZG0CYNR1
  rect 1.02x2 smd: 1(-6.35,0) 2(-3.81,0) 3(-1.27,0) 4(1.27,0) 5(3.81,0) 6(6.35,0)
LED-SMD_WS2812B-4020
  rect 0.42x1.3 smd: 1(1.275,0) 2(0.425,0) 3(-0.425,0) 4(-1.275,0)
M2螺丝
  round 2 hole 2: 1(0,0)
QFN-20_L3.0-W3.0-P0.40-BL
  custom 0.224x0.825 smd: 1(-0.8,-1.387) 5(0.8,-1.387) 11(0.8,1.387) 15(-0.8,1.387)
  rect 0.201x0.826 smd: 2(-0.399,-1.387) 3(0,-1.387) 4(0.402,-1.387) 12(0.402,1.387) 13(0,1.387) 14(-0.399,1.387)
  custom 0.825x0.224 smd: 6(1.387,-0.8) 10(1.387,0.8) 16(-1.387,0.8) 20(-1.387,-0.8)
  rect 0.826x0.201 smd: 7(1.387,-0.399) 8(1.387,0) 9(1.387,0.402) 17(-1.387,0.402) 18(-1.387,0) 19(-1.387,-0.399)
R0603
  rect 0.806x0.864 smd: 1(-0.753,0) 2(0.753,0)
触摸区域-焊盘
  rect 20.376x41.001 smd: 1(0,0)

## Nets
As in the schematic.

Pads without a net: SCREW5 1; SCREW6 1; SCREW7 1; SCREW8 1; U7 16 17 18 19

## Via types
v1: diameter 0.61, hole 0.305, Top Layer to Bottom Layer, 39 vias

## Routing (per net, layer and track width the routed paths; a pad name or vN(x,y) marks a point on that pad's centre or on a via; arc(x,y) is an arc through that point)
+5V: length 238.8
  Top Layer w0.254: LED1.2 77.16,4.93 v1(77.14,4.95) 76.63,5.46 54.84,5.46 ; LED2.2 54.33,4.26 54.33,4.95 54.84,5.46 ; 54.84,5.46 33.04,5.46 ; 33.04,5.46 32.69,5.11 32.69,4.21 LED3.2 ; 33.04,5.46 11.2,5.46 10.71,4.97 LED4.2 10.71,3.24 v1(9.83,2.36)
  Bottom Layer w0.254: v1(9.83,2.36) 5.61,2.36 0.73,7.24 0.73,38.38 2.12,39.76 2.98,39.76 3,39.78 ; v1(77.14,4.95) 83.94,4.95 86.28,7.29 86.28,34.42 84.45,36.25 75.11,36.25 74.52,36.83 74.52,38.3 76.22,40 76.24,39.99 80.27,39.99 85.98,45.69 85.98,90.3 82.24,94.03 78.27,94.03 U12.6
GND: length 146.5
  Bottom Layer w0.254: v1(5.84,5.94) 4.65,7.14 2.87,7.14 2.33,7.67 2.33,34.04 3,34.7
  Bottom Layer w0.381: v1(75.04,93.81) 75.05,93.79 75.05,92.28 75.36,91.97 82.57,91.97 85.01,89.53 85.01,47.22 78.97,41.17 74.85,41.17 73.63,39.95 73.63,36.65 75.36,34.92 76.22,34.92 76.27,34.87 84.45,34.87 85.57,33.76 85.57,8.76 v1(82.57,5.77)
  vias: v1(14.15,3.99) v1(36.24,3.99) v1(43.13,97.36) v1(44.73,95.35) v1(49.25,98.93) v1(50.06,94.69) v1(50.06,93.45) v1(55.29,98.98) v1(56,96.24) v1(57.99,4.19) v1(65.1,97.51) v1(68.59,97.46) v1(70.89,96.39) v1(75.05,94.87) v1(75.11,97.49) v1(77.27,97.49) v1(79.99,97.46) v1(80.13,2.92)
VCC3V3: length 209.2
  Bottom Layer w0.254: C2.1 46.29,99.47 41.09,99.47 40.84,99.21 11.68,99.21 6.32,93.85 3.38,93.85 0.68,91.16 0.68,43.61 1.78,42.52 76.06,42.52 ; C2.1 46.63,98.74 43.95,98.74 ; C2.1 47.58,98.17 49.6,98.17 50.98,99.54 53.36,99.54 54.28,98.63 ; 73.54,93.81 73.54,95.87 70.23,99.19 61.23,99.19 R3.2 60.83,98.79 60.83,98.27 60.12,97.56 55.45,97.56 54.43,98.58 R7.1
ELE0: length 36.5
  Bottom Layer w0.178: v1(76.53,89.84) 70.03,89.84 67.18,92.68 45.26,92.68 43.15,94.79 43.15,95.89
ELE1: length 76.3
  Bottom Layer w0.178: v1(73.89,48.34) 72.92,49.3 66.11,49.3 65.63,49.78 65.63,91.24 64.82,92.05 44.78,92.05 42.75,94.08 U7.9
ELE2: length 16.8
  Bottom Layer w0.178: 42.35,95.97 41.93,95.55 41.93,93.88 44.4,91.41 53.36,91.41 v1(54.84,89.94)
ELE3: length 58.9
  Bottom Layer w0.178: U7.11 41.22,96.01 41.22,93.42 43.69,90.96 43.69,50.06 44.24,49.5 53.01,49.5 v1(54.18,48.34)
ELE4: length 12.3
  Bottom Layer w0.178: v1(32.33,89.92) 37.69,95.28 39.19,95.28 40.87,96.96 U7.12
ELE5: length 75.6
  Bottom Layer w0.178: v1(32.74,48.29) 31.77,49.25 22.4,49.25 21.82,49.83 21.82,91.57 26.64,96.39 39.24,96.39 40.15,97.3 41.71,97.3 U7.13
ELE6: length 35.6
  Bottom Layer w0.178: 41.77,97.76 17.29,97.76 v1(9.45,89.92)
ELE7: length 94.2
  Bottom Layer w0.178: v1(10.49,48.23) 9.42,49.3 2.36,49.3 1.34,50.32 1.34,90.8 3.58,93.04 8.76,93.04 14.2,98.48 41.45,98.48 U7.15
LED_IN: length 118.7
  Top Layer w0.178: LED1.1 78.71,4.19 v1(78.76,4.14)
  Bottom Layer w0.178: 84.22,37.45 76.24,37.45 76.22,37.46 ; 84.22,37.45 84.29,37.45 86.89,40.06 86.89,91.87 83.18,95.58 77.09,95.58 76.54,95.04 76.54,93.81 ; 84.22,37.45 87.04,34.63 87.04,7.14 84.35,4.44 79.07,4.44 v1(78.76,4.14)
LED_OUT: length 42.4
  Top Layer w0.178: v1(9.27,5.51) 9.86,4.92 LED4.3
  Bottom Layer w0.178: v1(9.27,5.51) 8.46,5.51 6.73,3.78 5.36,3.78 1.52,7.62 1.52,36.68 2.09,37.25 2.98,37.25 3,37.24
MPR_ADDR: length 24.4
  Top Layer w0.178: v1(59.47,98.5) v1(59.47,96.8) ; v1(58.19,96.34) v1(58.19,93.9)
  Bottom Layer w0.178: R4.1 v1(58.19,93.9) 52.19,93.9 50.11,95.99 46.56,95.99 45.59,96.96 U7.4 ; R2.1 R3.1 v1(59.47,98.5) ; v1(58.19,96.34) 59.42,96.34 R5.1 v1(59.47,96.8)
MPR_IRQ: length 10
  Bottom Layer w0.178: U7.1 46.82,98.16 47.32,97.66 50.98,97.66 51.64,97 R6.2 R7.2
MPR_SCL: length 164.3
  Bottom Layer w0.178: 70.54,93.81 70.38,93.64 70.38,91.57 71.04,90.91 80.95,90.91 82.93,88.93 82.93,49.15 81.16,47.38 76.46,47.38 76.22,47.62 3.22,47.62 ; 44.54,97.76 46.41,97.76 47.06,97.1 50.67,97.1 52.45,95.33 59.91,95.33 R5.2 ; 70.53,94.77 69.42,95.88 61.54,95.88 61.03,96.39
MPR_SDA: length 166.7
  Top Layer w0.178: v1(72.06,94.77) 72.01,94.72 v1(69.42,94.72)
  Bottom Layer w0.178: U12.2 72.01,93.77 72.01,92.33 72.97,91.36 81.66,91.36 84,89.03 84,49.1 84.02,49.07 84.02,48.82 80.29,45.08 3.22,45.08 ; U7.3 46,97.36 46.81,96.55 50.47,96.55 52.25,94.77 60.11,94.77 R4.2 68.6,93.9 v1(69.42,94.72)
$1N5130: length 3
  Bottom Layer w0.178: U7.5 46.08,95.02 C1.2
$1N5218: length 4.8
  Bottom Layer w0.178: U7.7 43.55,95.51 45.66,93.4 47.02,93.4
$1N6408: length 23.5
  Top Layer w0.254: LED2.1 55.25,3.27 56.06,2.46 75.36,2.46 76.31,3.41 LED1.3
$1N6409: length 22.5
  Top Layer w0.254: LED3.1 33.56,3.27 34.52,2.31 52.44,2.31 53.55,3.41 LED2.3
$1N6410: length 22.8
  Top Layer w0.254: LED3.3 31.86,3.41 30.7,2.26 12.77,2.26 11.56,3.47 LED4.1

## Copper pours and planes (outline as drawn; the poured copper is in the pictures)
GND on Top Layer: -9.58,104.22 94.99,104.22 94.99,-2.11 -9.58,-2.11
GND on Bottom Layer: -10.11,104.19 94.89,104.19 94.89,-2.06 -10.11,-2.06

## Text on the board
Bottom Silkscreen Layer: JLCJLCJLCJLC | 4 | 1 | 2 | 3
